# Altium project STM32H747IGT6_IsolatedAudioDSP.PrjPcb
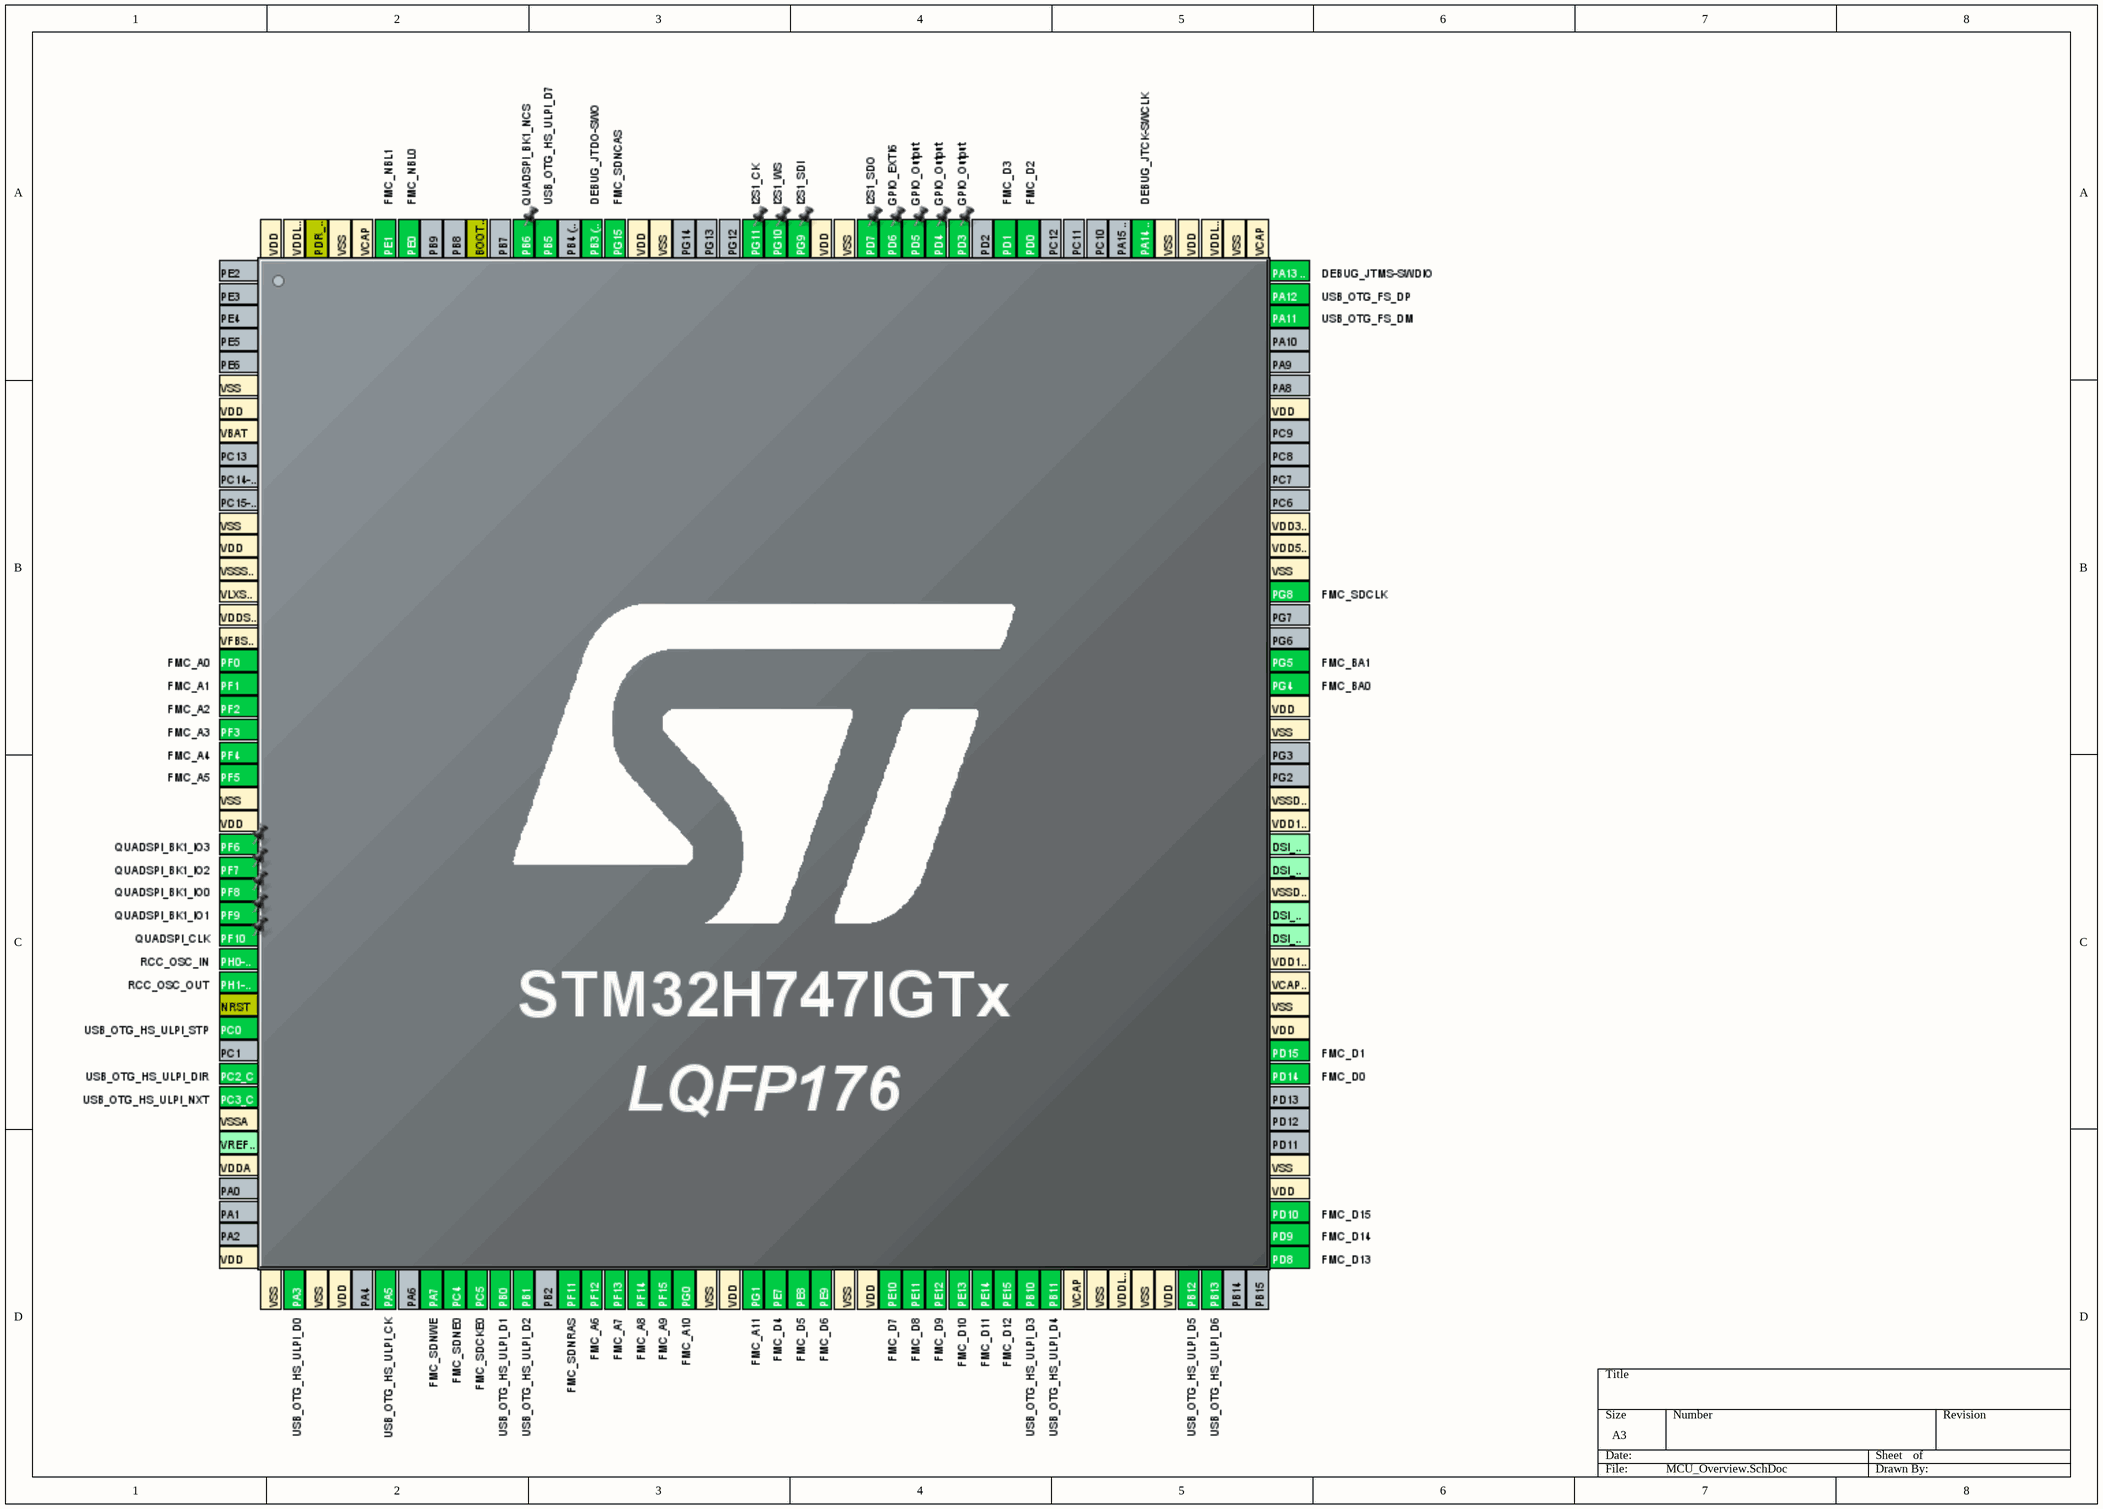
[diagram p0: MCU_Overview.SchDoc]
9 sheets, 181 parts. Net scope: global (net labels, ports and power ports of the same name join across sheets).
Board file: DSPBoardPCBDesign.PcbDoc
Sheets:
  MCU_Overview.SchDoc
  PowerSupply.SchDoc
  Decoupling.SchDoc
  MCUConfig.SchDoc
  SDRAMModule.SchDoc
  GPIOPins.SchDoc
  USBHSULPI.SchDoc
  IsolationBarriers.SchDoc
  AudioCodec.SchDoc

## Sheet MCU_Overview.SchDoc
size A3; SheetNumber: 1; SheetTotal: 7

## Sheet PowerSupply.SchDoc
size A4; SheetNumber: 2; SheetTotal: 8
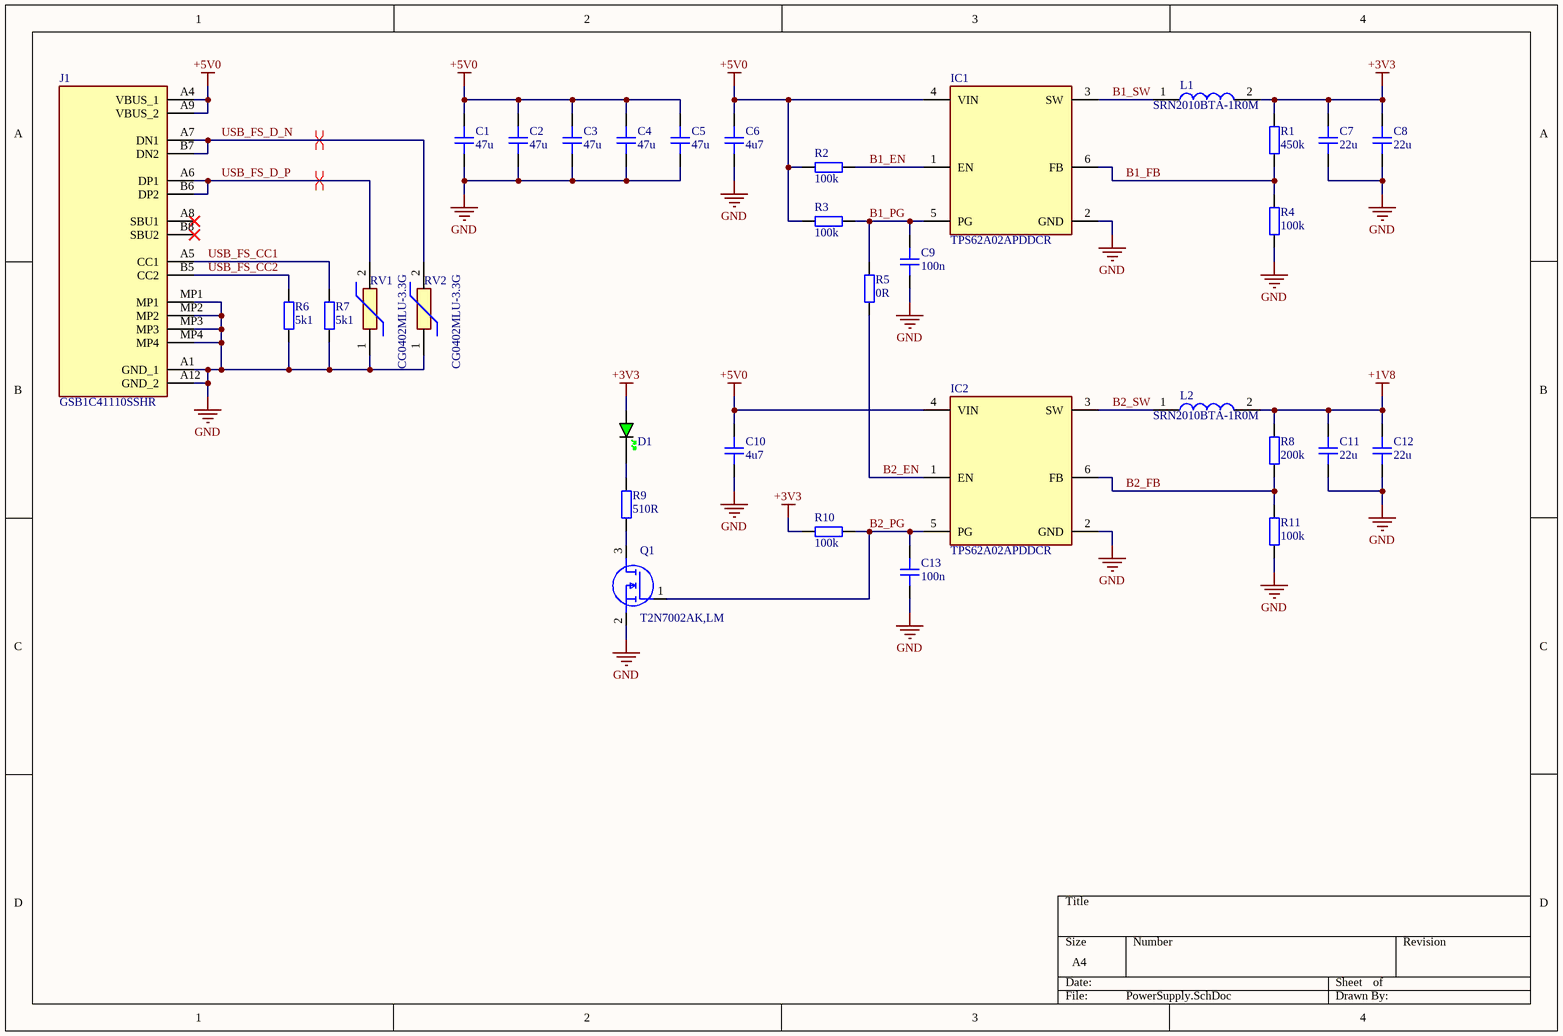
[diagram p1: PowerSupply.SchDoc]

### Parts
C1  47u  [CAP_1210]
C2  47u  [CAP_1210]
C3  47u  [CAP_1210]
C4  47u  [CAP_1210]
C5  47u  [CAP_1210]
C6  4u7  [CAP_0603]
C7  22u  [CAP_0603]
C8  22u  [CAP_0603]
C9  100n  [CAP_0402]
C10  4u7  [CAP_0603]
C11  22u  [CAP_0603]
C12  22u  [CAP_0603]
C13  100n  [CAP_0402]
D1  GREEN  [LED_0603_GREEN]  (value not drawn)
IC1  TPS62A02APDDCR  [SOT95P280X110-6N - duplicate]
IC2  TPS62A02APDDCR  [SOT95P280X110-6N - duplicate]
J1  GSB1C41110SSHR  [GSB1C41110SSHR]
L1  SRN2010BTA-1R0M  [SRN2010BTA1R0M]
L2  SRN2010BTA-1R0M  [SRN2010BTA1R0M]
Q1  T2N7002AK,LM  [TBAT54CLM]
R1  450k  [RES_0402]
R2  100k  [RES_0402]
R3  100k  [RES_0402]
R4  100k  [RES_0402]
R5  0R  [RES_0402]
R6  5k1  [RES_0402]
R7  5k1  [RES_0402]
R8  200k  [RES_0402]
R9  510R  [RES_0603]
R10  100k  [RES_0402]
R11  100k  [RES_0402]
RV1  CG0402MLU-3.3G  [VARC1005X41N]
RV2  CG0402MLU-3.3G  [VARC1005X41N]

### Nets
+1V8: C11.2 C12.2 L2.2 R8.2
+3V3: C7.2 C8.2 D1.A L1.2 R1.2 R10.1
+5V0: C1.2 C2.2 C3.2 C4.2 C5.2 C6.2 C10.2 IC1.4(VIN) IC2.4(VIN) J1.A4(VBUS_1) J1.A9(VBUS_2) R2.1 R3.1
GND: C1.1 C2.1 C3.1 C4.1 C5.1 C6.1 C7.1 C8.1 C9.1 C10.1 C11.1 C12.1 C13.1 IC1.2(GND) IC2.2(GND) J1.A1(GND_1) J1.A12(GND_2) J1.MP1 J1.MP2 J1.MP3 J1.MP4 Q1.2(S) R4.1 R6.2 R7.2 R11.1 RV1.1 RV2.1
B1_EN: IC1.1(EN) R2.2
B1_FB: IC1.6(FB) R1.1 R4.2
B1_PG: C9.2 IC1.5(PG) R3.2 R5.2
B1_SW: IC1.3(SW) L1.1
B2_EN: IC2.1(EN) R5.1
B2_FB: IC2.6(FB) R8.1 R11.2
B2_PG: C13.2 IC2.5(PG) Q1.1(G) R10.2
B2_SW: IC2.3(SW) L2.1
USB_FS_CC1: J1.A5(CC1) R7.1
USB_FS_CC2: J1.B5(CC2) R6.1
USB_FS_D_N: J1.A7(DN1) J1.B7(DN2) RV2.2
USB_FS_D_P: J1.A6(DP1) J1.B6(DP2) RV1.2
NetD1_K: D1.K R9.2
NetQ1_3: Q1.3(D) R9.1

Not connected (* = marked no-connect by the designer): J1 A8(SBU1)* B8(SBU2)*

### Layout directives
differential pair: USB_FS_D_N, USB_FS_D_P

### Library data of the parts
C1-C5 = CAP_1210: Capacitor SMD 1210; Manufacturer: *; Manufacturer Part Number: *; Distributor Link: *; LCSC: *; Rating: *; Dielectric: *
C6-C8 C10-C12 = CAP_0603: Capacitor SMD 0603; Manufacturer: *; Manufacturer Part Number: *; Distributor Link: *; LCSC: *; Rating: *; Dielectric: *
C9 C13 = CAP_0402: Capacitor SMD 0402; Manufacturer: *; Manufacturer Part Number: *; Distributor Link: *; LCSC: *; Rating: *; Dielectric: *
D1 = LED_0603_GREEN: LED 0603 GREEN SMD
IC1 IC2 = TPS62A02APDDCR: Integrated Circuit; Manufacturer_Name: Texas Instruments; Datasheet Link: https://www.ti.com/lit/ds/symlink/tps62a02a.pdf?ts=1731815729746&ref_url=https%253A%252F%252Fwww.ti.com%252Fproduct%252FTPS62A02A%252Fpart-details%252FTPS62A02APDDCR%253Futm_source%253Dgoogle%2526utm_medium%253Dcpc%2526utm_campaign%253Docb-tistore-null-ap; Height: 1.1mm; Manufacturer_Part_Number: TPS62A02APDDCR; Mouser Part Number: 595-TPS62A02APDDCR; Mouser Price/Stock: https://www.mouser.co.uk/ProductDetail/Texas-Instruments/TPS62A02APDDCR?qs=ZcfC38r4PotJY8Nb5BNo3Q%3D%3D; Arrow Part Number: TPS62A02APDDCR; Arrow Price/Stock: https://www.arrow.com/en/products/tps62a02apddcr/texas-instruments?utm_currency=USD&region=nac
J1 = GSB1C41110SSHR: Connector; Manufacturer_Name: Amphenol Communications Solutions; Datasheet Link: https://cdn.amphenol-cs.com/media/wysiwyg/files/drawing/gsb1c41x10sshr-ax1.pdf; Height: 3.41mm; Manufacturer_Part_Number: GSB1C41110SSHR
L1 L2 = SRN2010BTA-1R0M: Inductor; Manufacturer_Name: Bourns; Datasheet Link: https://www.bourns.com/docs/Product-Datasheets/SRN2010BTA.pdf; Height: 1mm; Manufacturer_Part_Number: SRN2010BTA-1R0M
Q1 = T2N7002AK,LM: MOSFET (N-Channel); Manufacturer_Name: Toshiba; Datasheet Link: http://toshiba.semicon-storage.com/info/docget.jsp?did=29712&prodName=T2N7002AK; Height: 1.1mm; Manufacturer_Part_Number: T2N7002AK,LM; Mouser Part Number: 757-T2N7002AKLM; Mouser Price/Stock: https://www.mouser.co.uk/ProductDetail/Toshiba/T2N7002AKLM?qs=pzVvXTvk9PzfX4hYglwZ9Q%3D%3D; Arrow Part Number: T2N7002AK,LM; Arrow Price/Stock: https://www.arrow.com/en/products/t2n7002aklm/toshiba?region=nac
R1-R8 R10 R11 = RES_0402: Resistor SMD 0402; Manufacturer: *; Manufacturer Part Number: *; Distributor Link: *; LCSC: *
R9 = RES_0603: Resistor SMD 0603; Manufacturer: *; Manufacturer Part Number: *; Distributor Link: *; LCSC: *
RV1 RV2 = CG0402MLU-3.3G: ESD Diode; Manufacturer_Name: Bourns; Datasheet Link: https://www.bourns.com/docs/Product-Datasheets/MLU.pdf; Height: 0.41mm; Manufacturer_Part_Number: CG0402MLU-3.3G; Mouser Part Number: 652-CG0402MLU-3.3G; Mouser Price/Stock: https://www.mouser.co.uk/ProductDetail/Bourns/CG0402MLU-3.3G?qs=m8myXnDJXpWVM8EQWErxtQ%3D%3D; Arrow Part Number: CG0402MLU-3.3G; Arrow Price/Stock: https://www.arrow.com/en/products/cg0402mlu-3.3g/bourns?utm_currency=USD&region=nac

## Sheet Decoupling.SchDoc
size A4; SheetNumber: 3; SheetTotal: 8
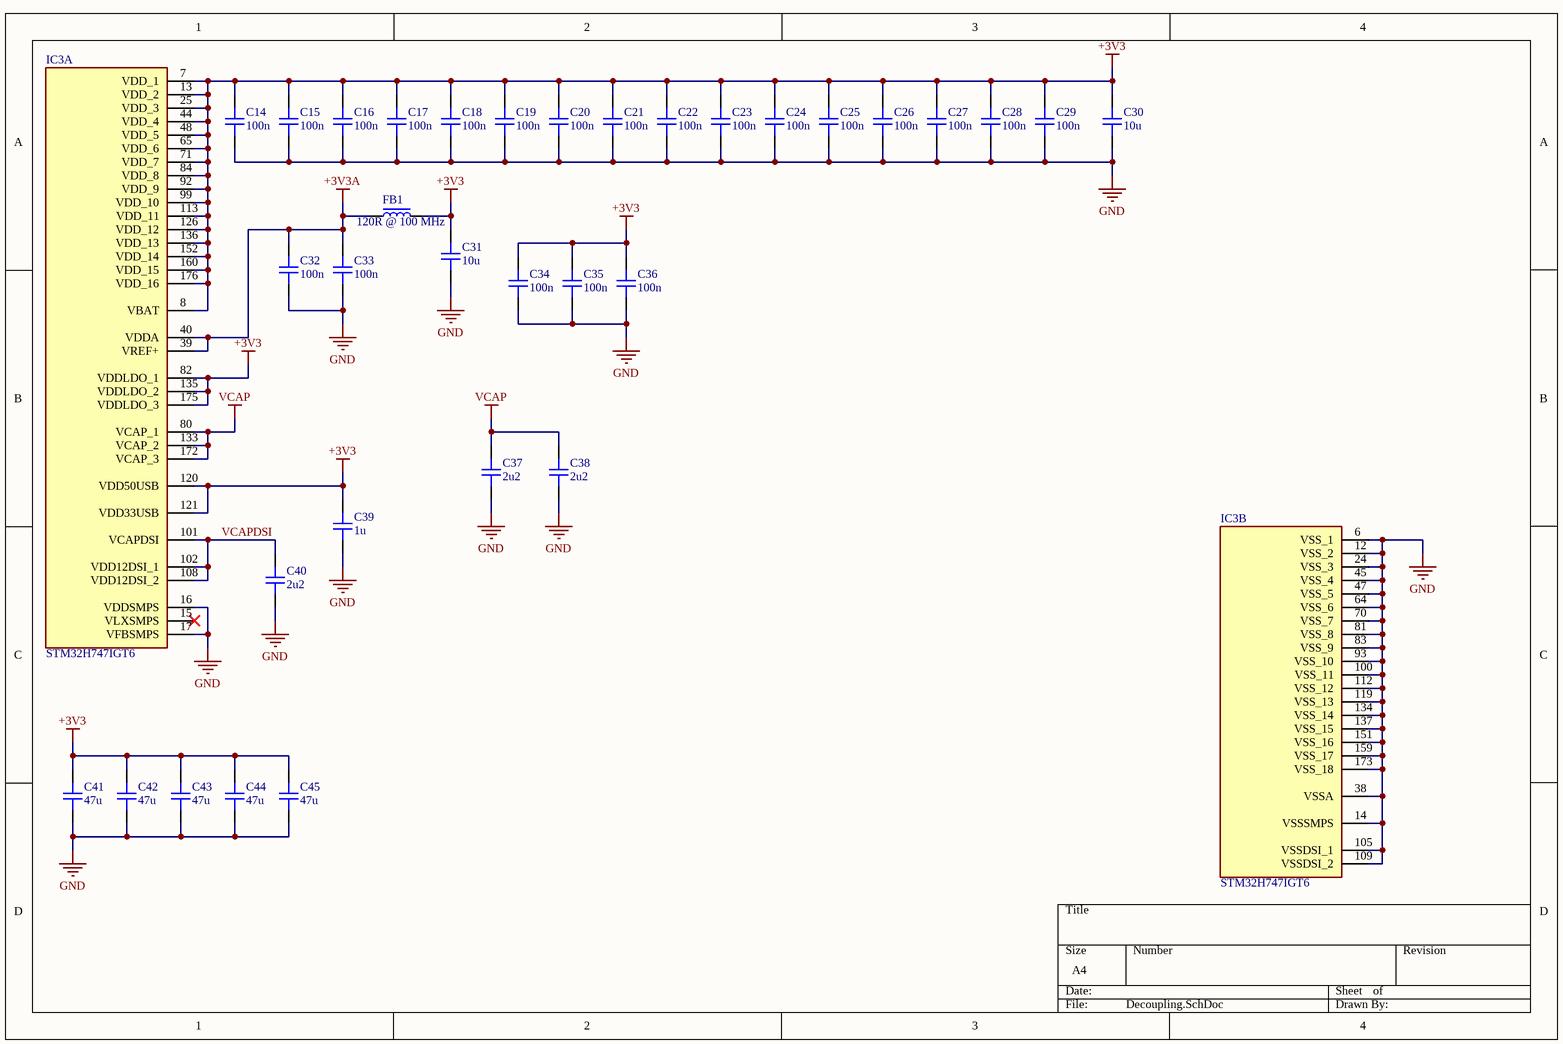
[diagram p2: Decoupling.SchDoc]

### Parts
C14  100n  [CAP_0402]
C15  100n  [CAP_0402]
C16  100n  [CAP_0402]
C17  100n  [CAP_0402]
C18  100n  [CAP_0402]
C19  100n  [CAP_0402]
C20  100n  [CAP_0402]
C21  100n  [CAP_0402]
C22  100n  [CAP_0402]
C23  100n  [CAP_0402]
C24  100n  [CAP_0402]
C25  100n  [CAP_0402]
C26  100n  [CAP_0402]
C27  100n  [CAP_0402]
C28  100n  [CAP_0402]
C29  100n  [CAP_0402]
C30  10u  [CAP_0603]
C31  10u  [CAP_0603]
C32  100n  [CAP_0402]
C33  100n  [CAP_0402]
C34  100n  [CAP_0402]
C35  100n  [CAP_0402]
C36  100n  [CAP_0402]
C37  2u2  [CAP_0402]
C38  2u2  [CAP_0402]
C39  1u  [CAP_0402]
C40  2u2  [CAP_0402]
C41  47u  [CAP_1210]
C42  47u  [CAP_1210]
C43  47u  [CAP_1210]
C44  47u  [CAP_1210]
C45  47u  [CAP_1210]
FB1  120R @ 100 MHz  [FB_0402]
IC3  STM32H747IGT6  [QFP50P2600X2600X160-176N]  (parts A,B of 10)

### Nets
+3V3: C14.2 C15.2 C16.2 C17.2 C18.2 C19.2 C20.2 C21.2 C22.2 C23.2 C24.2 C25.2 C26.2 C27.2 C28.2 C29.2 C30.2 C31.2 C34.2 C35.2 C36.2 C39.2 C41.2 C42.2 C43.2 C44.2 C45.2 FB1.2 IC3.7(VDD_1) IC3.8(VBAT) IC3.13(VDD_2) IC3.25(VDD_3) IC3.44(VDD_4) IC3.48(VDD_5) IC3.65(VDD_6) IC3.71(VDD_7) IC3.82(VDDLDO_1) IC3.84(VDD_8) IC3.92(VDD_9) IC3.99(VDD_10) IC3.113(VDD_11) IC3.120(VDD50USB) IC3.121(VDD33USB) IC3.126(VDD_12) IC3.135(VDDLDO_2) IC3.136(VDD_13) IC3.152(VDD_14) IC3.160(VDD_15) IC3.175(VDDLDO_3) IC3.176(VDD_16)
+3V3A: C32.2 C33.2 FB1.1 IC3.39(VREF+) IC3.40(VDDA)
GND: C14.1 C15.1 C16.1 C17.1 C18.1 C19.1 C20.1 C21.1 C22.1 C23.1 C24.1 C25.1 C26.1 C27.1 C28.1 C29.1 C30.1 C31.1 C32.1 C33.1 C34.1 C35.1 C36.1 C37.1 C38.1 C39.1 C40.1 C41.1 C42.1 C43.1 C44.1 C45.1 IC3.6(VSS_1) IC3.12(VSS_2) IC3.14(VSSSMPS) IC3.16(VDDSMPS) IC3.17(VFBSMPS) IC3.24(VSS_3) IC3.38(VSSA) IC3.45(VSS_4) IC3.47(VSS_5) IC3.64(VSS_6) IC3.70(VSS_7) IC3.81(VSS_8) IC3.83(VSS_9) IC3.93(VSS_10) IC3.100(VSS_11) IC3.105(VSSDSI_1) IC3.109(VSSDSI_2) IC3.112(VSS_12) IC3.119(VSS_13) IC3.134(VSS_14) IC3.137(VSS_15) IC3.151(VSS_16) IC3.159(VSS_17) IC3.173(VSS_18)
VCAP: C37.2 C38.2 IC3.80(VCAP_1) IC3.133(VCAP_2) IC3.172(VCAP_3)
VCAPDSI: C40.2 IC3.101(VCAPDSI) IC3.102(VDD12DSI_1) IC3.108(VDD12DSI_2)

Not connected (* = marked no-connect by the designer): IC3 15(VLXSMPS)*

### Library data of the parts
C14-C29 C32-C40 = CAP_0402: Capacitor SMD 0402; Manufacturer: *; Manufacturer Part Number: *; Distributor Link: *; LCSC: *; Rating: *; Dielectric: *
C30 C31 = CAP_0603: Capacitor SMD 0603; Manufacturer: *; Manufacturer Part Number: *; Distributor Link: *; LCSC: *; Rating: *; Dielectric: *
C41-C45 = CAP_1210: Capacitor SMD 1210; Manufacturer: *; Manufacturer Part Number: *; Distributor Link: *; LCSC: *; Rating: *; Dielectric: *
FB1 = FB_0402: Ferrite Bead SMD 0402; Manufacturer: *; Manufacturer Part Number: *; Distributor Link: *; LCSC: *
IC3 = STM32H747IGT6: Integrated Circuit; Manufacturer_Name: STMicroelectronics; Datasheet Link: https://www.mouser.com/datasheet/2/389/dm00602212-1799407.pdf; Height: 1.6mm; Manufacturer_Part_Number: STM32H747IGT6; Mouser Part Number: 511-STM32H747IGT6; Mouser Price/Stock: https://www.mouser.co.uk/ProductDetail/STMicroelectronics/STM32H747IGT6?qs=%252B6g0mu59x7Kw%252BsPEalqvLg%3D%3D; Arrow Part Number: STM32H747IGT6; Arrow Price/Stock: null?region=nac

## Sheet MCUConfig.SchDoc
size A4; SheetNumber: 4; SheetTotal: 8
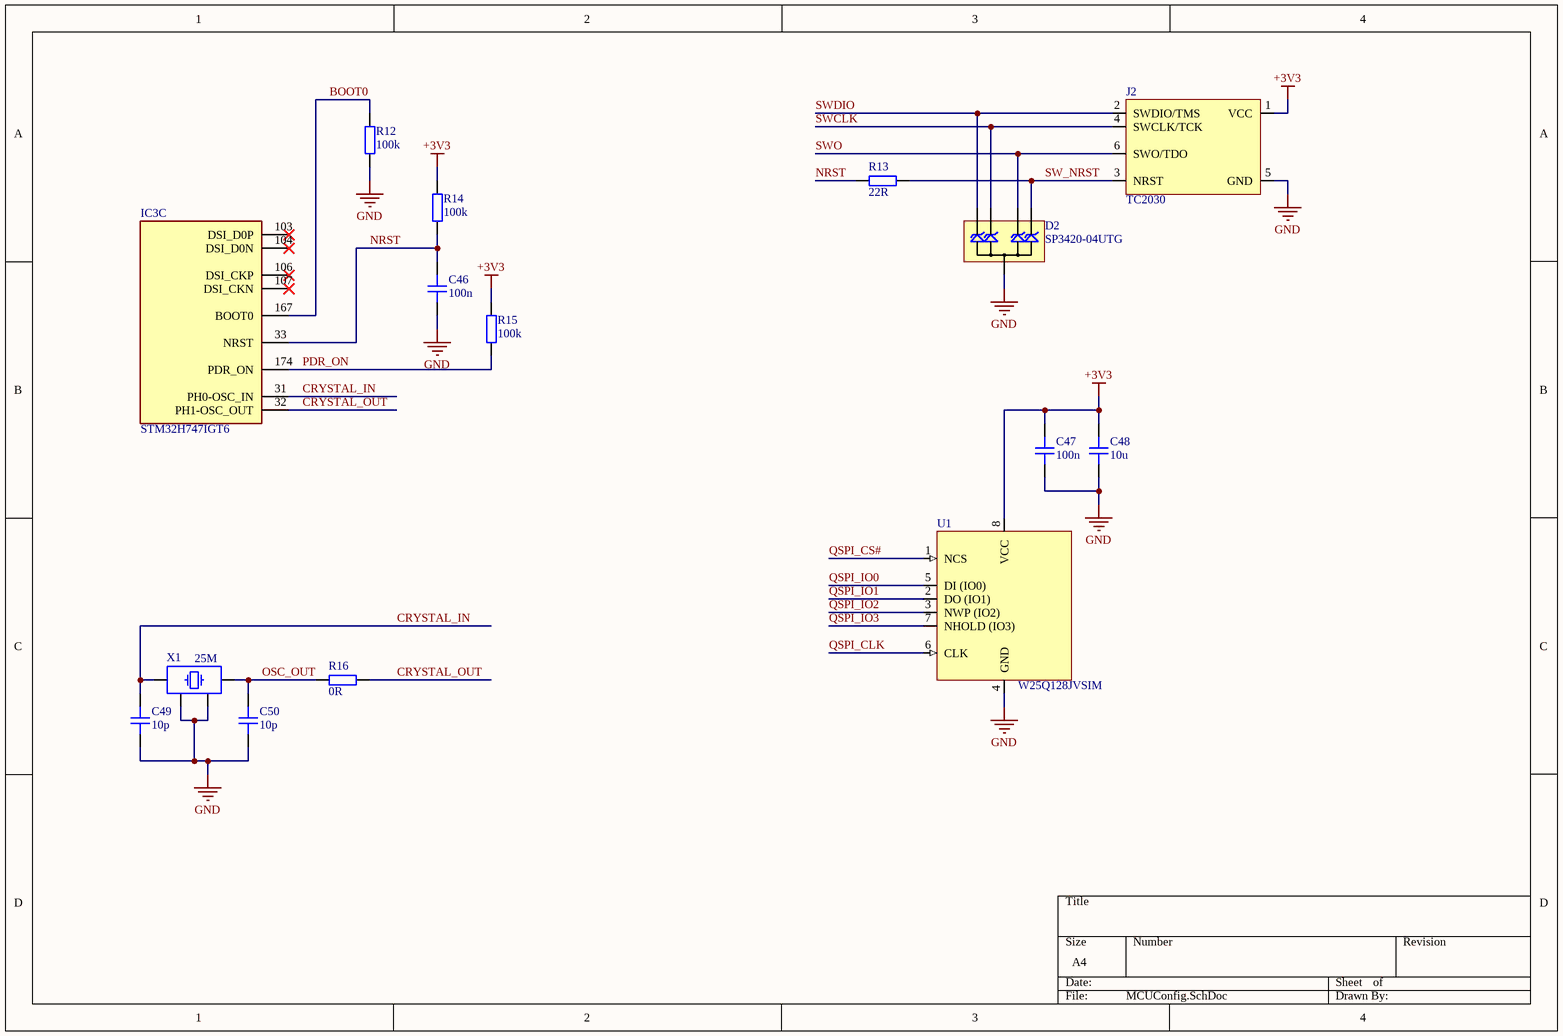
[diagram p3: MCUConfig.SchDoc]

### Parts
C46  100n  [CAP_0402]
C47  100n  [CAP_0402]
C48  10u  [CAP_0603]
C49  10p  [CAP_0402]
C50  10p  [CAP_0402]
D2  SP3420-04UTG  [uDFN-10]
IC3  STM32H747IGT6  [QFP50P2600X2600X160-176N]  (part C of 10)
J2  TC2030  [TC2030-FP]  (no BOM)
R12  100k  [RES_0402]
R13  22R  [RES_0402]
R14  100k  [RES_0402]
R15  100k  [RES_0402]
R16  0R  [RES_0402]
U1  W25Q128JVSIM  [SOIC-8]
X1  25M  [XTAL_3225]

### Nets
+3V3: C47.2 C48.2 J2.1(VCC) R14.2 R15.2 U1.8(VCC)
GND: C46.1 C47.1 C48.1 C49.1 C50.1 D2.38(GND) J2.5(GND) R12.1 U1.4(GND) X1.2 X1.4
BOOT0: IC3.167(BOOT0) R12.2
CRYSTAL_IN: C49.2 IC3.31(PH0-OSC_IN) X1.1
CRYSTAL_OUT: IC3.32(PH1-OSC_OUT) R16.2
NRST: C46.2 IC3.33(NRST) R13.2 R14.1
OSC_OUT: C50.2 R16.1 X1.3
PDR_ON: IC3.174(PDR_ON) R15.1
QSPI_CLK: U1.6(CLK)
QSPI_CS#: U1.1(NCS)
QSPI_IO0: U1.5(DI_(IO0))
QSPI_IO1: U1.2(DO_(IO1))
QSPI_IO2: U1.3(NWP_(IO2))
QSPI_IO3: U1.7(NHOLD_(IO3))
SW_NRST: D2.56 J2.3(NRST) R13.1
SWCLK: D2.29 J2.4(SWCLK/TCK)
SWDIO: D2.110 J2.2(SWDIO/TMS)
SWO: D2.47 J2.6(SWO/TDO)

Not connected (* = marked no-connect by the designer): IC3 103(DSI_D0P)* 104(DSI_D0N)* 106(DSI_CKP)* 107(DSI_CKN)*

### Library data of the parts
C46 C47 C49 C50 = CAP_0402: Capacitor SMD 0402; Manufacturer: *; Manufacturer Part Number: *; Distributor Link: *; LCSC: *; Rating: *; Dielectric: *
C48 = CAP_0603: Capacitor SMD 0603; Manufacturer: *; Manufacturer Part Number: *; Distributor Link: *; LCSC: *; Rating: *; Dielectric: *
D2 = SP3420-04UTG: TVS Diode Array Low Capacitance ESD Protection 4-Channel (Vwork=3V3, Vclamp=6V); Manufacturer: Littelfuse; Manufacturer Part Number: SP3420-04UTG
IC3 = STM32H747IGT6: as IC3 on sheet Decoupling; Datasheet Link: https://www.mouser.com/datasheet/2/389/dm00602212-1799407.pdf; Height: 1.6mm; Manufacturer_Part_Number: STM32H747IGT6; Mouser Part Number: 511-STM32H747IGT6; Mouser Price/Stock: https://www.mouser.co.uk/ProductDetail/STMicroelectronics/STM32H747IGT6?qs=%252B6g0mu59x7Kw%252BsPEalqvLg%3D%3D; Arrow Part Number: STM32H747IGT6; Arrow Price/Stock: null?region=nac
J2 = TC2030: Tag-Connect No-Solder SWD Debug Connector DO NOT PLACE; Manufacturer: Tag-Connect; Manufacturer Part Number: TC2030
R12-R16 = RES_0402: Resistor SMD 0402; Manufacturer: *; Manufacturer Part Number: *; Distributor Link: *; LCSC: *
U1 = W25Q128JVSIM: 128M-BIT / SERIAL FLASH MEMORY WITH / DUAL/QUAD SPI & QPI & DTR SOIC-8; Manufacturer: Winbond; Manufacturer Part Number: W25Q128JVSIM
X1 = XTAL_3225: Crystal SMD 3225; Distributor Link: *

## Sheet SDRAMModule.SchDoc
size A4; SheetNumber: 5; SheetTotal: 8
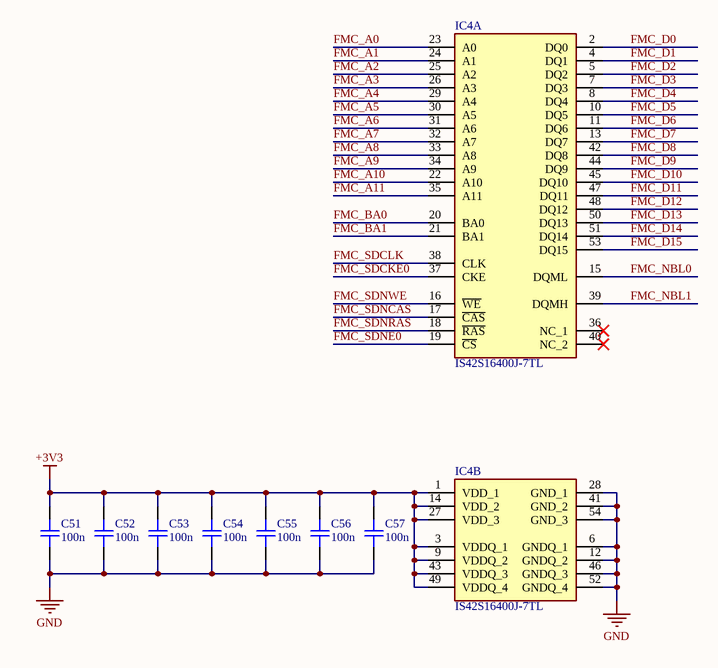
[diagram p4: SDRAMModule.SchDoc]

### Parts
C51  100n  [CAP_0402]
C52  100n  [CAP_0402]
C53  100n  [CAP_0402]
C54  100n  [CAP_0402]
C55  100n  [CAP_0402]
C56  100n  [CAP_0402]
C57  100n  [CAP_0402]
IC4  IS42S16400J-7TL  [SOP80P1176X120-54N]  (parts A,B of 2)

### Nets
+3V3: C51.2 C52.2 C53.2 C54.2 C55.2 C56.2 C57.2 IC4.1(VDD_1) IC4.3(VDDQ_1) IC4.9(VDDQ_2) IC4.14(VDD_2) IC4.27(VDD_3) IC4.43(VDDQ_3) IC4.49(VDDQ_4)
GND: C51.1 C52.1 C53.1 C54.1 C55.1 C56.1 C57.1 IC4.6(GNDQ_1) IC4.12(GNDQ_2) IC4.28(GND_1) IC4.41(GND_2) IC4.46(GNDQ_3) IC4.52(GNDQ_4) IC4.54(GND_3)
FMC_A0: IC4.23(A0)
FMC_A1: IC4.24(A1)
FMC_A2: IC4.25(A2)
FMC_A3: IC4.26(A3)
FMC_A4: IC4.29(A4)
FMC_A5: IC4.30(A5)
FMC_A6: IC4.31(A6)
FMC_A7: IC4.32(A7)
FMC_A8: IC4.33(A8)
FMC_A9: IC4.34(A9)
FMC_A10: IC4.22(A10)
FMC_A11: IC4.35(A11)
FMC_BA0: IC4.20(BA0)
FMC_BA1: IC4.21(BA1)
FMC_D0: IC4.2(DQ0)
FMC_D1: IC4.4(DQ1)
FMC_D2: IC4.5(DQ2)
FMC_D3: IC4.7(DQ3)
FMC_D4: IC4.8(DQ4)
FMC_D5: IC4.10(DQ5)
FMC_D6: IC4.11(DQ6)
FMC_D7: IC4.13(DQ7)
FMC_D8: IC4.42(DQ8)
FMC_D9: IC4.44(DQ9)
FMC_D10: IC4.45(DQ10)
FMC_D11: IC4.47(DQ11)
FMC_D12: IC4.48(DQ12)
FMC_D13: IC4.50(DQ13)
FMC_D14: IC4.51(DQ14)
FMC_D15: IC4.53(DQ15)
FMC_NBL0: IC4.15(DQML)
FMC_NBL1: IC4.39(DQMH)
FMC_SDCKE0: IC4.37(CKE)
FMC_SDCLK: IC4.38(CLK)
FMC_SDNCAS: IC4.17(~{CAS})
FMC_SDNE0: IC4.19(~{CS})
FMC_SDNRAS: IC4.18(~{RAS})
FMC_SDNWE: IC4.16(~{WE})

Not connected (* = marked no-connect by the designer): IC4 36(NC_1)* 40(NC_2)*

### Library data of the parts
C51-C57 = CAP_0402: Capacitor SMD 0402; Manufacturer: *; Manufacturer Part Number: *; Distributor Link: *; LCSC: *; Rating: *; Dielectric: *
IC4 = IS42S16400J-7TL: Integrated Circuit; Manufacturer_Name: Integrated Silicon Solution Inc.; Datasheet Link: http://www.issi.com/WW/pdf/42-45S16400J.pdf; Height: 1.2mm; Manufacturer_Part_Number: IS42S16400J-7TL; Mouser Part Number: 870-IS42S16400J-7TL; Mouser Price/Stock: https://www.mouser.co.uk/ProductDetail/ISSI/IS42S16400J-7TL?qs=eOmjsnl%2FhF6%2FoT1%252B3blFIA%3D%3D; Arrow Part Number: IS42S16400J-7TL; Arrow Price/Stock: https://www.arrow.com/en/products/is42s16400j-7tl/integrated-silicon-solution-inc?region=europe

## Sheet GPIOPins.SchDoc
size A4; SheetNumber: 6; SheetTotal: 8
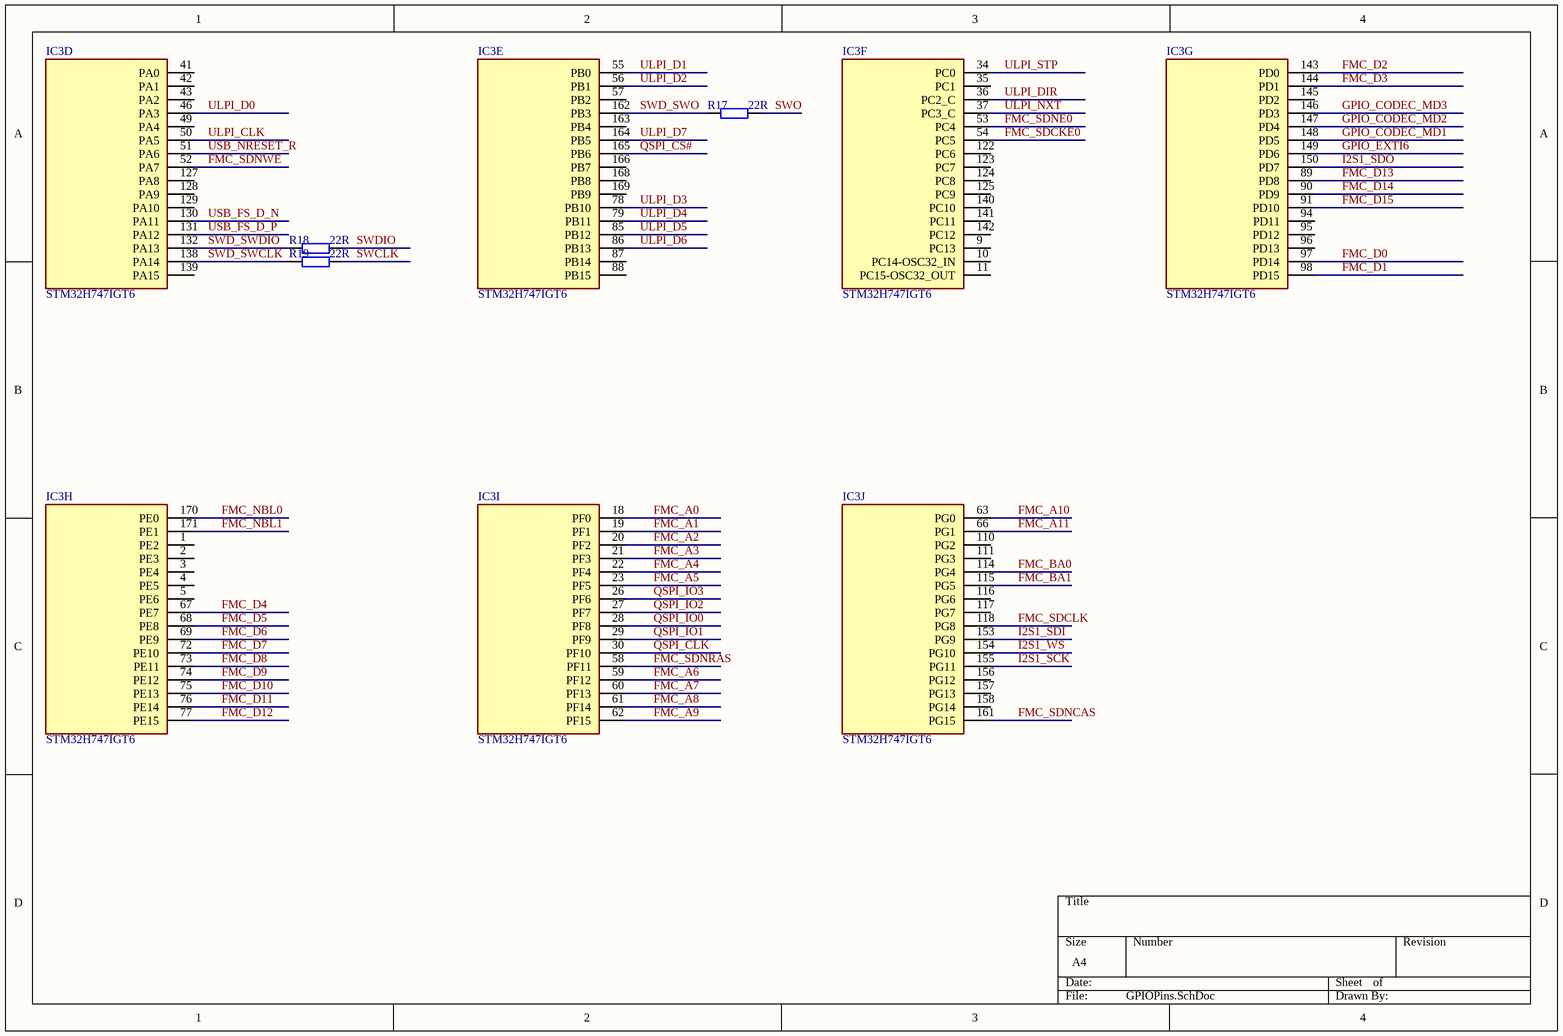
[diagram p5: GPIOPins.SchDoc]

### Parts
IC3  STM32H747IGT6  [QFP50P2600X2600X160-176N]  (parts D,E,F,G,H,I,J of 10)
R17  22R  [RES_0402]
R18  22R  [RES_0402]
R19  22R  [RES_0402]

### Nets
FMC_A0: IC3.18(PF0)
FMC_A1: IC3.19(PF1)
FMC_A2: IC3.20(PF2)
FMC_A3: IC3.21(PF3)
FMC_A4: IC3.22(PF4)
FMC_A5: IC3.23(PF5)
FMC_A6: IC3.59(PF12)
FMC_A7: IC3.60(PF13)
FMC_A8: IC3.61(PF14)
FMC_A9: IC3.62(PF15)
FMC_A10: IC3.63(PG0)
FMC_A11: IC3.66(PG1)
FMC_BA0: IC3.114(PG4)
FMC_BA1: IC3.115(PG5)
FMC_D0: IC3.97(PD14)
FMC_D1: IC3.98(PD15)
FMC_D2: IC3.143(PD0)
FMC_D3: IC3.144(PD1)
FMC_D4: IC3.67(PE7)
FMC_D5: IC3.68(PE8)
FMC_D6: IC3.69(PE9)
FMC_D7: IC3.72(PE10)
FMC_D8: IC3.73(PE11)
FMC_D9: IC3.74(PE12)
FMC_D10: IC3.75(PE13)
FMC_D11: IC3.76(PE14)
FMC_D12: IC3.77(PE15)
FMC_D13: IC3.89(PD8)
FMC_D14: IC3.90(PD9)
FMC_D15: IC3.91(PD10)
FMC_NBL0: IC3.170(PE0)
FMC_NBL1: IC3.171(PE1)
FMC_SDCKE0: IC3.54(PC5)
FMC_SDCLK: IC3.118(PG8)
FMC_SDNCAS: IC3.161(PG15)
FMC_SDNE0: IC3.53(PC4)
FMC_SDNRAS: IC3.58(PF11)
FMC_SDNWE: IC3.52(PA7)
GPIO_CODEC_MD1: IC3.148(PD5)
GPIO_CODEC_MD2: IC3.147(PD4)
GPIO_CODEC_MD3: IC3.146(PD3)
GPIO_EXTI6: IC3.149(PD6)
I2S1_SCK: IC3.155(PG11)
I2S1_SDI: IC3.153(PG9)
I2S1_SDO: IC3.150(PD7)
I2S1_WS: IC3.154(PG10)
QSPI_CLK: IC3.30(PF10)
QSPI_CS#: IC3.165(PB6)
QSPI_IO0: IC3.28(PF8)
QSPI_IO1: IC3.29(PF9)
QSPI_IO2: IC3.27(PF7)
QSPI_IO3: IC3.26(PF6)
SWCLK: R19.1
SWD_SWCLK: IC3.138(PA14) R19.2
SWD_SWDIO: IC3.132(PA13) R18.2
SWD_SWO: IC3.162(PB3) R17.2
SWDIO: R18.1
SWO: R17.1
ULPI_CLK: IC3.50(PA5)
ULPI_D0: IC3.46(PA3)
ULPI_D1: IC3.55(PB0)
ULPI_D2: IC3.56(PB1)
ULPI_D3: IC3.78(PB10)
ULPI_D4: IC3.79(PB11)
ULPI_D5: IC3.85(PB12)
ULPI_D6: IC3.86(PB13)
ULPI_D7: IC3.164(PB5)
ULPI_DIR: IC3.36(PC2_C)
ULPI_NXT: IC3.37(PC3_C)
ULPI_STP: IC3.34(PC0)
USB_FS_D_N: IC3.130(PA11)
USB_FS_D_P: IC3.131(PA12)
USB_NRESET_R: IC3.51(PA6)

Not connected (* = marked no-connect by the designer): IC3 1(PE2) 2(PE3) 3(PE4) 4(PE5) 5(PE6) 9(PC13) 10(PC14-OSC32_IN) 11(PC15-OSC32_OUT) 35(PC1) 41(PA0) 42(PA1) 43(PA2) 49(PA4) 57(PB2) 87(PB14) 88(PB15) 94(PD11) 95(PD12) 96(PD13) 110(PG2) 111(PG3) 116(PG6) 117(PG7) 122(PC6) 123(PC7) 124(PC8) 125(PC9) 127(PA8) 128(PA9) 129(PA10) 139(PA15) 140(PC10) 141(PC11) 142(PC12) 145(PD2) 156(PG12) 157(PG13) 158(PG14) 163(PB4) 166(PB7) 168(PB8) 169(PB9)

### Library data of the parts
IC3 = STM32H747IGT6: as IC3 on sheet Decoupling; Datasheet Link: https://www.mouser.com/datasheet/2/389/dm00602212-1799407.pdf; Height: 1.6mm; Manufacturer_Part_Number: STM32H747IGT6; Mouser Part Number: 511-STM32H747IGT6; Mouser Price/Stock: https://www.mouser.co.uk/ProductDetail/STMicroelectronics/STM32H747IGT6?qs=%252B6g0mu59x7Kw%252BsPEalqvLg%3D%3D; Arrow Part Number: STM32H747IGT6; Arrow Price/Stock: null?region=nac
R17-R19 = RES_0402: Resistor SMD 0402; Manufacturer: *; Manufacturer Part Number: *; Distributor Link: *; LCSC: *

## Sheet USBHSULPI.SchDoc
size A4; SheetNumber: 7; SheetTotal: 8
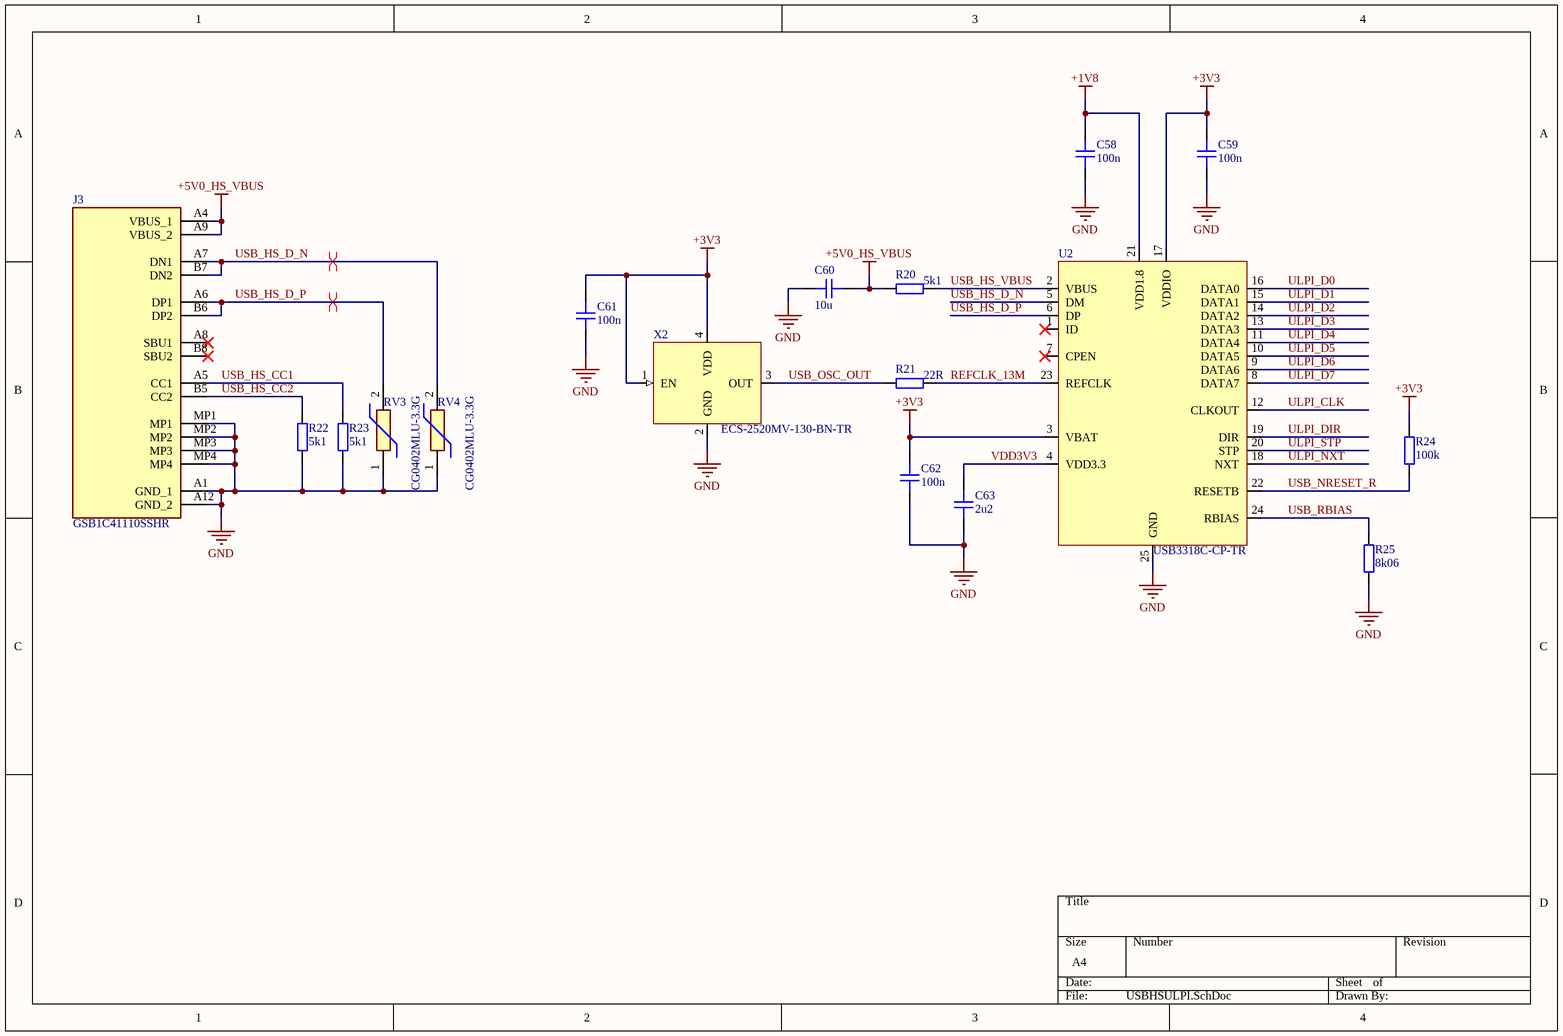
[diagram p6: USBHSULPI.SchDoc]

### Parts
C58  100n  [CAP_0402]
C59  100n  [CAP_0402]
C60  10u  [CAP_0603]
C61  100n  [CAP_0402]
C62  100n  [CAP_0402]
C63  2u2  [CAP_0402]
J3  GSB1C41110SSHR  [GSB1C41110SSHR]
R20  5k1  [RES_0402]
R21  22R  [RES_0402]
R22  5k1  [RES_0402]
R23  5k1  [RES_0402]
R24  100k  [RES_0402]
R25  8k06  [RES_0402]
RV3  CG0402MLU-3.3G  [VARC1005X41N]
RV4  CG0402MLU-3.3G  [VARC1005X41N]
U2  USB3318C-CP-TR  [QFN50P400X400X100-25N-D]
X2  ECS-2520MV-130-BN-TR  [XTAL_2520]

### Nets
+1V8: C58.2 U2.21(VDD1.8)
+3V3: C59.2 C61.2 C62.2 R24.1 U2.3(VBAT) U2.17(VDDIO) X2.1(EN) X2.4(VDD)
+5V0_HS_VBUS: C60.1 J3.A4(VBUS_1) J3.A9(VBUS_2) R20.2
GND: C58.1 C59.1 C60.2 C61.1 C62.1 C63.1 J3.A1(GND_1) J3.A12(GND_2) J3.MP1 J3.MP2 J3.MP3 J3.MP4 R22.2 R23.2 R25.1 RV3.1 RV4.1 U2.25(GND) X2.2(GND)
REFCLK_13M: R21.1 U2.23(REFCLK)
ULPI_CLK: U2.12(CLKOUT)
ULPI_D0: U2.16(DATA0)
ULPI_D1: U2.15(DATA1)
ULPI_D2: U2.14(DATA2)
ULPI_D3: U2.13(DATA3)
ULPI_D4: U2.11(DATA4)
ULPI_D5: U2.10(DATA5)
ULPI_D6: U2.9(DATA6)
ULPI_D7: U2.8(DATA7)
ULPI_DIR: U2.19(DIR)
ULPI_NXT: U2.18(NXT)
ULPI_STP: U2.20(STP)
USB_HS_CC1: J3.A5(CC1) R23.1
USB_HS_CC2: J3.B5(CC2) R22.1
USB_HS_D_N: J3.A7(DN1) J3.B7(DN2) RV4.2 U2.5(DM)
USB_HS_D_P: J3.A6(DP1) J3.B6(DP2) RV3.2 U2.6(DP)
USB_HS_VBUS: R20.1 U2.2(VBUS)
USB_NRESET_R: R24.2 U2.22(RESETB)
USB_OSC_OUT: R21.2 X2.3(OUT)
USB_RBIAS: R25.2 U2.24(RBIAS)
VDD3V3: C63.2 U2.4(VDD3.3)

Not connected (* = marked no-connect by the designer): J3 A8(SBU1)* B8(SBU2)*; U2 1(ID)* 7(CPEN)*

### Layout directives
differential pair: USB_HS_D_N, USB_HS_D_P

### Library data of the parts
C58 C59 C61-C63 = CAP_0402: Capacitor SMD 0402; Manufacturer: *; Manufacturer Part Number: *; Distributor Link: *; LCSC: *; Rating: *; Dielectric: *
C60 = CAP_0603: Capacitor SMD 0603; Manufacturer: *; Manufacturer Part Number: *; Distributor Link: *; LCSC: *; Rating: *; Dielectric: *
J3 = GSB1C41110SSHR: as J1 on sheet PowerSupply; Datasheet Link: https://cdn.amphenol-cs.com/media/wysiwyg/files/drawing/gsb1c41x10sshr-ax1.pdf; Height: 3.41mm; Manufacturer_Part_Number: GSB1C41110SSHR
R20-R25 = RES_0402: Resistor SMD 0402; Manufacturer: *; Manufacturer Part Number: *; Distributor Link: *; LCSC: *
RV3 RV4 = CG0402MLU-3.3G: ESD Diode; Manufacturer_Name: Bourns; Datasheet Link: https://www.bourns.com/docs/Product-Datasheets/MLU.pdf; Height: 0.41mm; Manufacturer_Part_Number: CG0402MLU-3.3G; Mouser Part Number: 652-CG0402MLU-3.3G; Mouser Price/Stock: https://www.mouser.co.uk/ProductDetail/Bourns/CG0402MLU-3.3G?qs=m8myXnDJXpWVM8EQWErxtQ%3D%3D; Arrow Part Number: CG0402MLU-3.3G; Arrow Price/Stock: https://www.arrow.com/en/products/cg0402mlu-3.3g/bourns?utm_currency=USD&region=nac
U2 = USB3318C-CP-TR: USB Interface IC High Speed USB 1.8V ULPI; Manufacturer: Microchip; Manufacturer Part Number: USB3318C-CP-TR
X2 = ECS-2520MV-130-BN-TR: Standard Clock Oscillators XO (Standard),13MHz,Standby (Power Down),CMOS, Multi-Volt,1.6 V 3.6 V,+/-50ppm,-40 C 85 C,6mA,Surface Mount,4-SMD, No Lead,(2.50mm x 2.00mm),(0.80mm); Manufacturer: ECS; Manufacturer Part Number: ECS-2520MV-130-BN-TR

## Sheet IsolationBarriers.SchDoc
size A4; SheetNumber: 8; SheetTotal: 9
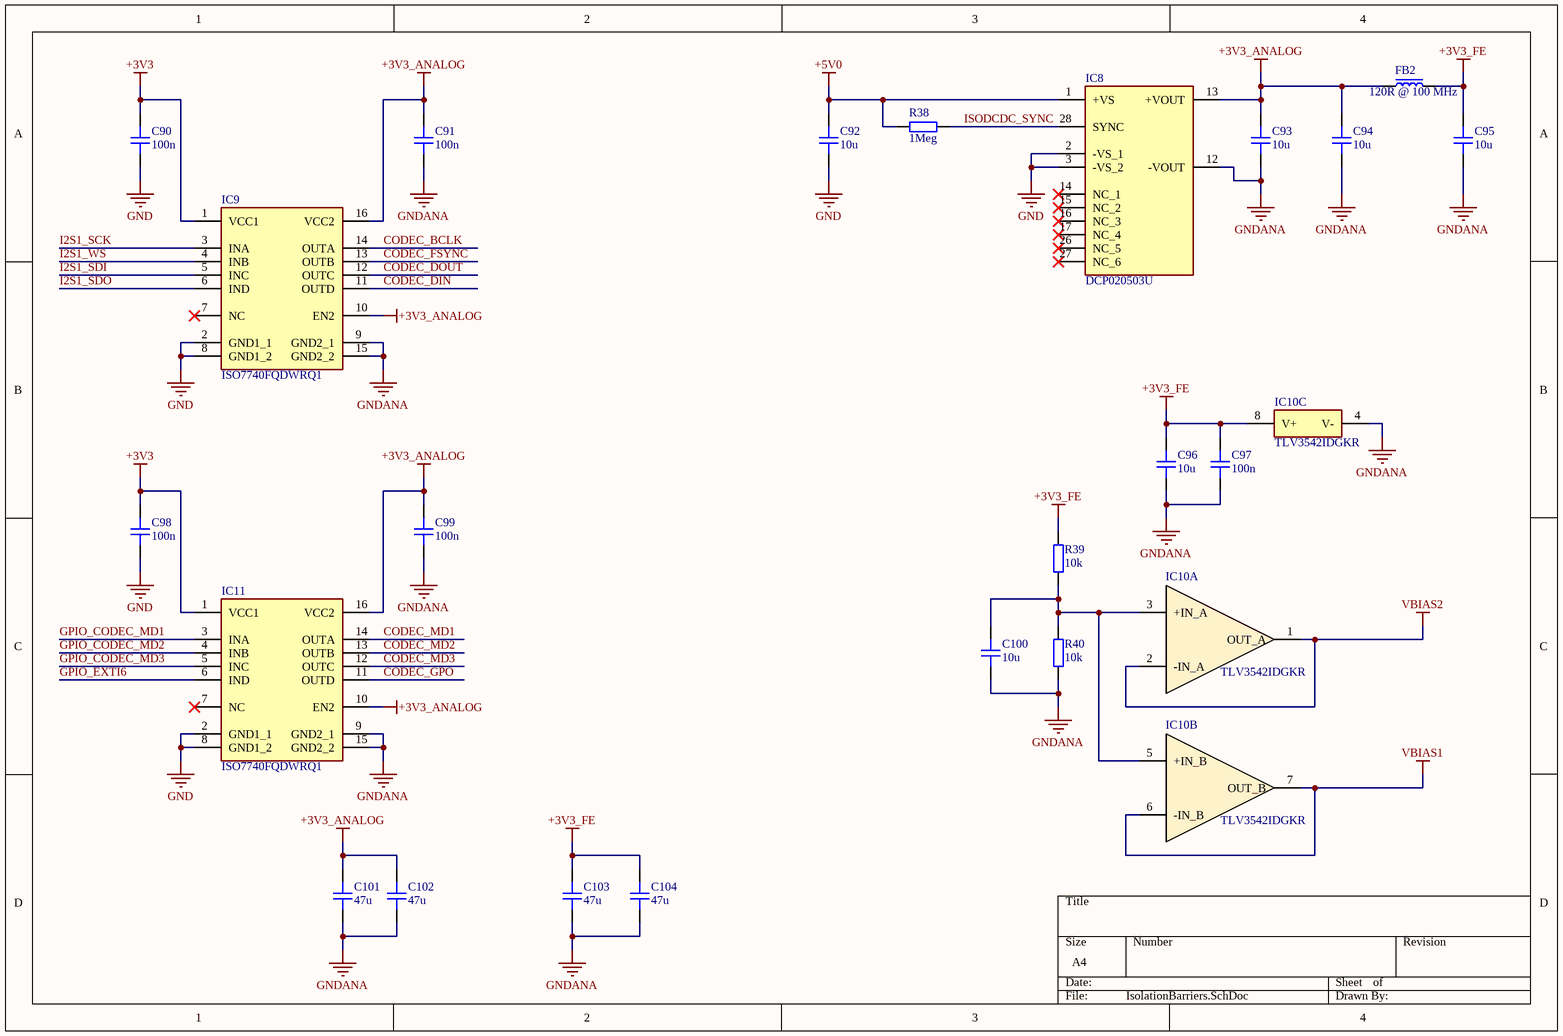
[diagram p7: IsolationBarriers.SchDoc]

### Parts
C90  100n  [CAP_0402]
C91  100n  [CAP_0402]
C92  10u  [CAP_0603]
C93  10u  [CAP_0603]
C94  10u  [CAP_0603]
C95  10u  [CAP_0603]
C96  10u  [CAP_0603]
C97  100n  [CAP_0402]
C98  100n  [CAP_0402]
C99  100n  [CAP_0402]
C100  10u  [CAP_0603]
C101  47u  [CAP_1210]
C102  47u  [CAP_1210]
C103  47u  [CAP_1210]
C104  47u  [CAP_1210]
FB2  120R @ 100 MHz  [FB_0603]
IC8  DCP020503U  [DVB0012A]
IC9  ISO7740FQDWRQ1  [SOIC127P1030X265-16N]
IC10  TLV3542IDGKR  [SOP65P490X110-8N]  (parts A,B,C of 3)
IC11  ISO7740FQDWRQ1  [SOIC127P1030X265-16N]
R38  1Meg  [RES_0402]
R39  10k  [RES_0603]
R40  10k  [RES_0603]

### Nets
+3V3: C90.2 C98.2 IC9.1(VCC1) IC11.1(VCC1)
+3V3_ANALOG: C91.2 C93.2 C94.2 C99.2 C101.2 C102.2 FB2.1 IC8.13(+VOUT) IC9.10(EN2) IC9.16(VCC2) IC11.10(EN2) IC11.16(VCC2)
+3V3_FE: C95.2 C96.2 C97.2 C103.2 C104.2 FB2.2 IC10.8(V+) R39.2
+5V0: C92.2 IC8.1(+VS) R38.1
GND: C90.1 C92.1 C98.1 IC8.2(-VS_1) IC8.3(-VS_2) IC9.2(GND1_1) IC9.8(GND1_2) IC11.2(GND1_1) IC11.8(GND1_2)
GNDANA: C91.1 C93.1 C94.1 C95.1 C96.1 C97.1 C99.1 C100.1 C101.1 C102.1 C103.1 C104.1 IC8.12(-VOUT) IC9.9(GND2_1) IC9.15(GND2_2) IC10.4(V-) IC11.9(GND2_1) IC11.15(GND2_2) R40.1
VBIAS1: IC10.6(-IN_B) IC10.7(OUT_B)
VBIAS2: IC10.1(OUT_A) IC10.2(-IN_A)
CODEC_BCLK: IC9.14(OUTA)
CODEC_DIN: IC9.11(OUTD)
CODEC_DOUT: IC9.12(OUTC)
CODEC_FSYNC: IC9.13(OUTB)
CODEC_GPO: IC11.11(OUTD)
CODEC_MD1: IC11.14(OUTA)
CODEC_MD2: IC11.13(OUTB)
CODEC_MD3: IC11.12(OUTC)
GPIO_CODEC_MD1: IC11.3(INA)
GPIO_CODEC_MD2: IC11.4(INB)
GPIO_CODEC_MD3: IC11.5(INC)
GPIO_EXTI6: IC11.6(IND)
I2S1_SCK: IC9.3(INA)
I2S1_SDI: IC9.5(INC)
I2S1_SDO: IC9.6(IND)
I2S1_WS: IC9.4(INB)
ISODCDC_SYNC: IC8.28(SYNC) R38.2
NetC100_2: C100.2 IC10.3(+IN_A) IC10.5(+IN_B) R39.1 R40.2

Not connected (* = marked no-connect by the designer): IC8 14(NC_1)* 15(NC_2)* 16(NC_3)* 17(NC_4)* 26(NC_5)* 27(NC_6)*; IC9 7(NC)*; IC11 7(NC)*

### Library data of the parts
C90 C91 C97-C99 = CAP_0402: Capacitor SMD 0402; Manufacturer: *; Manufacturer Part Number: *; Distributor Link: *; LCSC: *; Rating: *; Dielectric: *
C92-C96 C100 = CAP_0603: Capacitor SMD 0603; Manufacturer: *; Manufacturer Part Number: *; Distributor Link: *; LCSC: *; Rating: *; Dielectric: *
C101-C104 = CAP_1210: Capacitor SMD 1210; Manufacturer: *; Manufacturer Part Number: *; Distributor Link: *; LCSC: *; Rating: *; Dielectric: *
FB2 = FB_0603: Ferrite Bead SMD 0603; Manufacturer: *; Manufacturer Part Number: *; Distributor Link: *; LCSC: *
IC8 = DCP020503U: TI Isolated DC DC Converter; Manufacturer_Name: Texas Instruments; Datasheet Link: http://www.ti.com/lit/gpn/dcp020503; Manufacturer_Part_Number: DCP020503U; Mouser Part Number: 595-DCP020503U; Mouser Price/Stock: https://www.mouser.com/Search/Refine.aspx?Keyword=595-DCP020503U; Arrow Part Number: DCP020503U; Arrow Price/Stock: https://www.arrow.com/en/products/dcp020503u/texas-instruments
IC9 IC11 = ISO7740FQDWRQ1: Integrated Circuit; Manufacturer_Name: Texas Instruments; Datasheet Link: https://www.ti.com/lit/gpn/iso7740-q1; Height: 2.65mm; Manufacturer_Part_Number: ISO7740FQDWRQ1; Mouser Part Number: 595-ISO7740FQDWRQ1; Mouser Price/Stock: https://www.mouser.co.uk/ProductDetail/Texas-Instruments/ISO7740FQDWRQ1?qs=34RfhUjJmKfM2MieHZI64w%3D%3D; Arrow Part Number: ISO7740FQDWRQ1; Arrow Price/Stock: https://www.arrow.com/en/products/iso7740fqdwrq1/texas-instruments?utm_currency=USD&region=nac
IC10 = TLV3542IDGKR: Integrated Circuit; Manufacturer_Name: Texas Instruments; Datasheet Link: http://www.ti.com/lit/gpn/tlv3542; Height: 1.1mm; Manufacturer_Part_Number: TLV3542IDGKR; Mouser Part Number: 595-TLV3542IDGKR; Mouser Price/Stock: https://www.mouser.co.uk/ProductDetail/Texas-Instruments/TLV3542IDGKR?qs=9lcNTSmDlCr5gl2sVJgJdw%3D%3D; Arrow Part Number: TLV3542IDGKR; Arrow Price/Stock: https://www.arrow.com/en/products/tlv3542idgkr/texas-instruments
R38 = RES_0402: Resistor SMD 0402; Manufacturer: *; Manufacturer Part Number: *; Distributor Link: *; LCSC: *
R39 R40 = RES_0603: Resistor SMD 0603; Manufacturer: *; Manufacturer Part Number: *; Distributor Link: *; LCSC: *

## Sheet AudioCodec.SchDoc
size A3; SheetNumber: 9; SheetTotal: 8
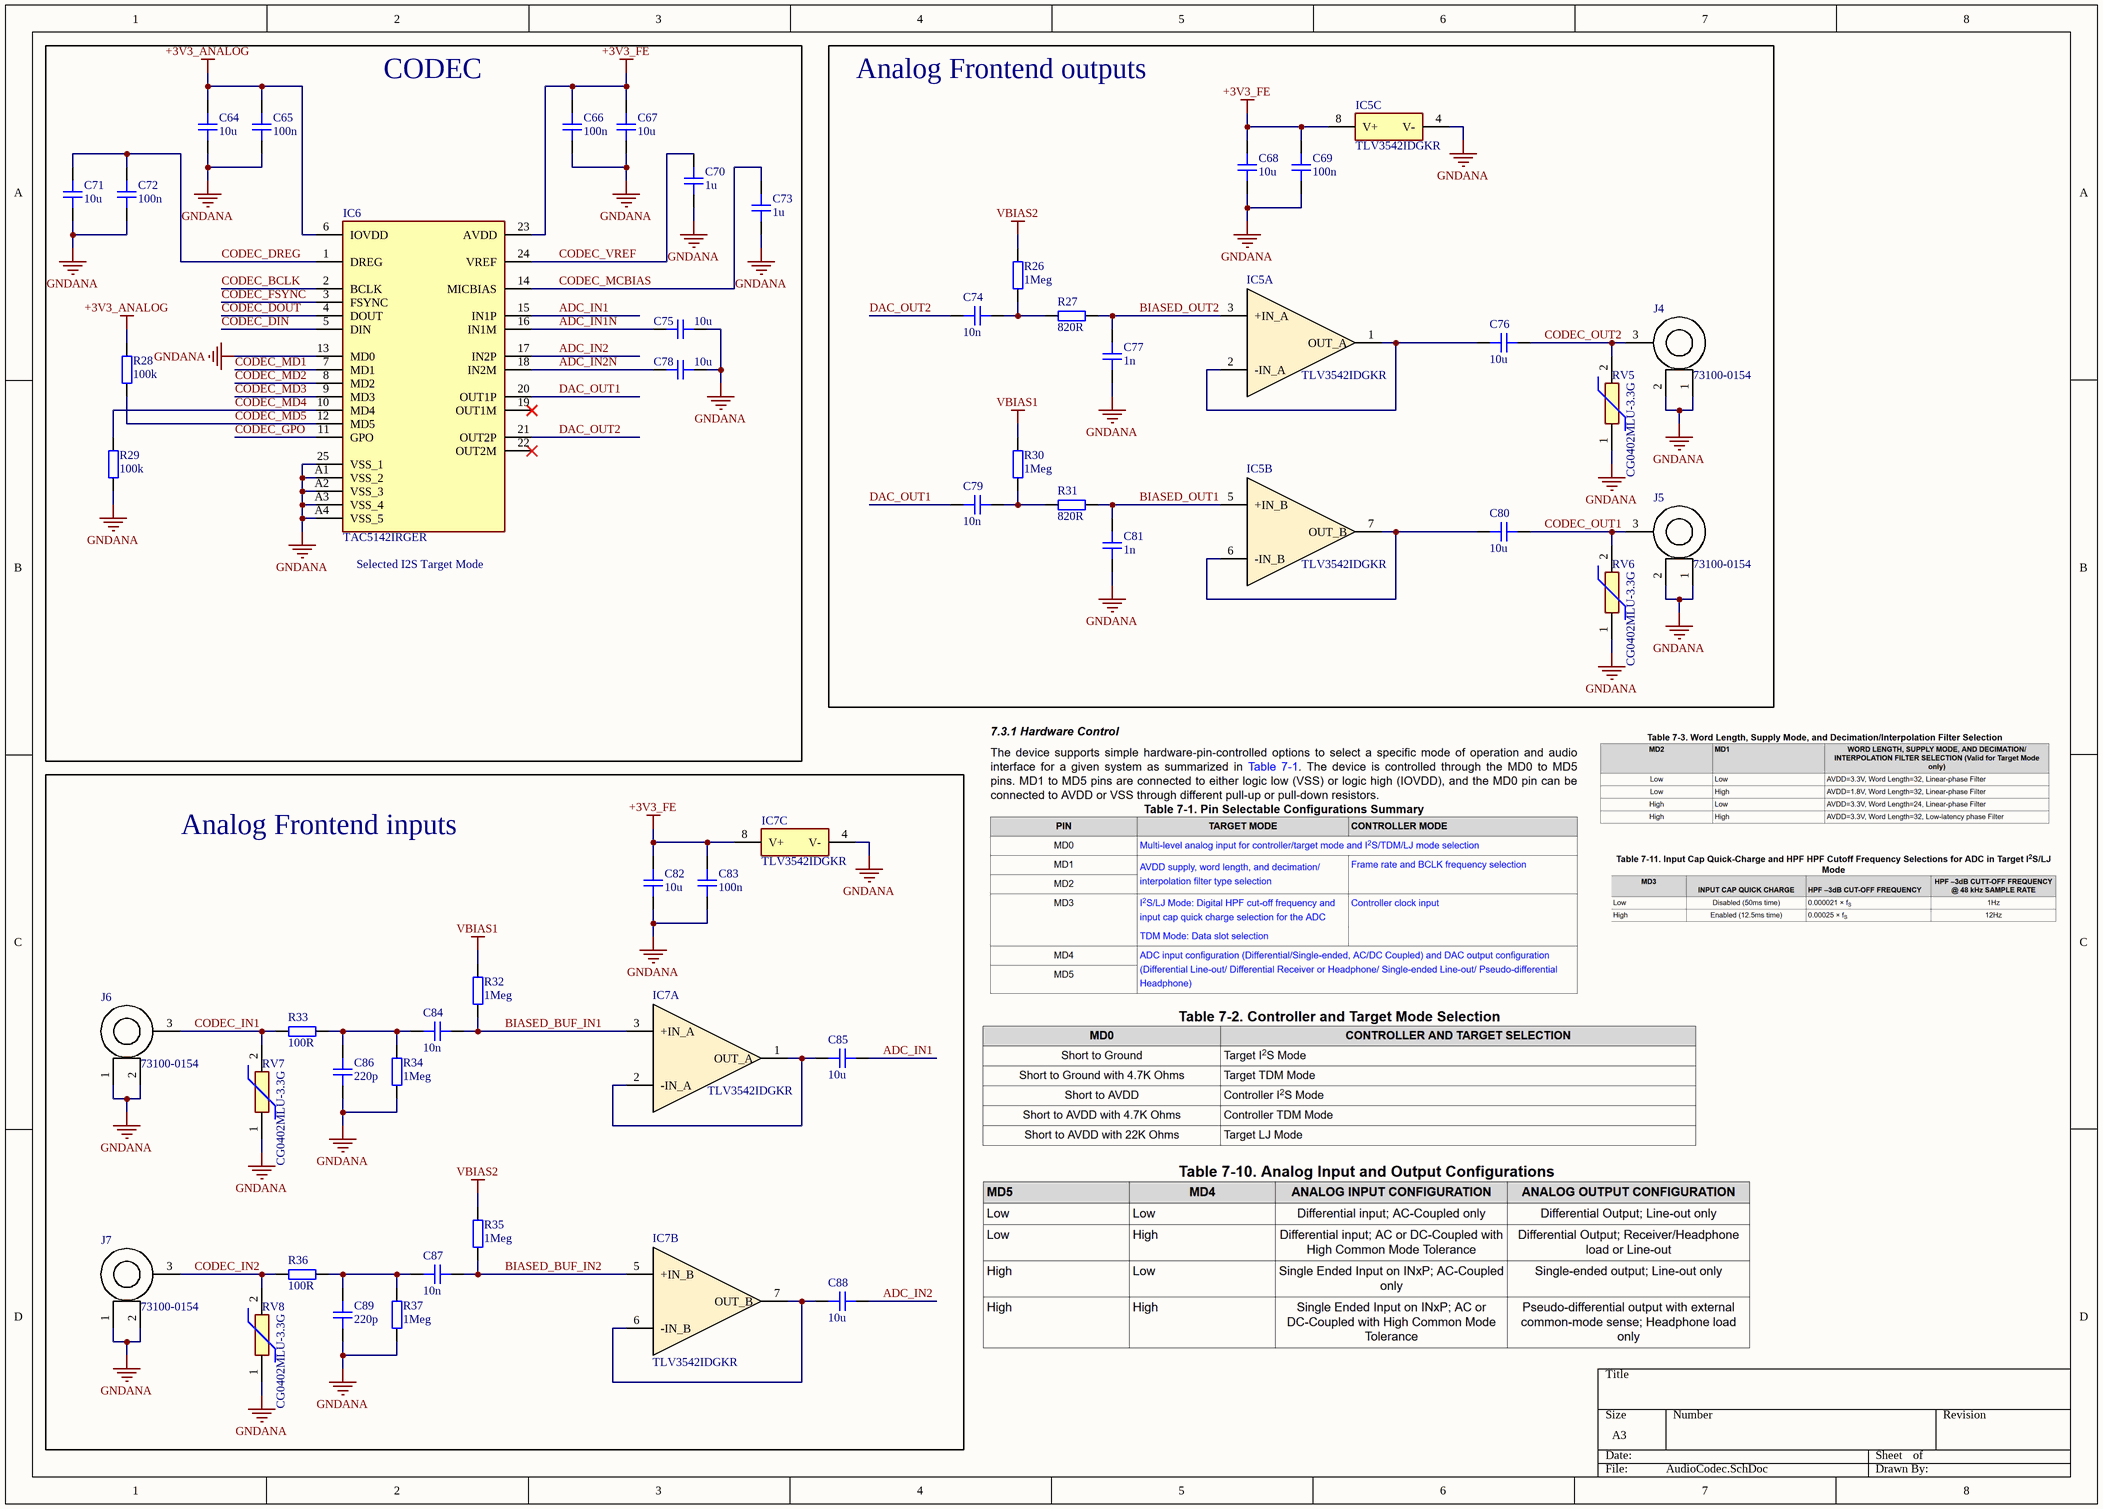
[diagram p8: AudioCodec.SchDoc]

### Parts
C64  10u  [CAP_0603]
C65  100n  [CAP_0402]
C66  100n  [CAP_0402]
C67  10u  [CAP_0603]
C68  10u  [CAP_0603]
C69  100n  [CAP_0402]
C70  1u  [CAP_0402]
C71  10u  [CAP_0603]
C72  100n  [CAP_0402]
C73  1u  [CAP_0402]
C74  10n  [CAP_0402]
C75  10u  [CAP_0603]
C76  10u  [CAP_0603]
C77  1n  [CAP_0402]
C78  10u  [CAP_0603]
C79  10n  [CAP_0402]
C80  10u  [CAP_0603]
C81  1n  [CAP_0402]
C82  10u  [CAP_0603]
C83  100n  [CAP_0402]
C84  10n  [CAP_0402]
C85  10u  [CAP_0603]
C86  220p  [CAP_0402]
C87  10n  [CAP_0402]
C88  10u  [CAP_0603]
C89  220p  [CAP_0402]
IC5  TLV3542IDGKR  [SOP65P490X110-8N]  (parts A,B,C of 3)
IC6  TAC5142IRGER  [TAC5142IRGER]
IC7  TLV3542IDGKR  [SOP65P490X110-8N]  (parts A,B,C of 3)
J4  73100-0154  [73100-0105]
J5  73100-0154  [73100-0105]
J6  73100-0154  [73100-0105]
J7  73100-0154  [73100-0105]
R26  1Meg  [RES_0402]
R27  820R  [RES_0402]
R28  100k  [RES_0402]
R29  100k  [RES_0402]
R30  1Meg  [RES_0402]
R31  820R  [RES_0402]
R32  1Meg  [RES_0402]
R33  100R  [RES_0402]
R34  1Meg  [RES_0402]
R35  1Meg  [RES_0402]
R36  100R  [RES_0402]
R37  1Meg  [RES_0402]
RV5  CG0402MLU-3.3G  [VARC1005X41N]
RV6  CG0402MLU-3.3G  [VARC1005X41N]
RV7  CG0402MLU-3.3G  [VARC1005X41N]
RV8  CG0402MLU-3.3G  [VARC1005X41N]

### Blocks framed on the sheet
CODEC: C64-C67 C70-C73 C75 C78 IC6 R28 R29
Analog Frontend outputs: C68 C69 C74 C76 C77 C79-C81 IC5 J4 J5 R26 R27 R30 R31 RV5 RV6
Analog Frontend inputs: C82-C89 IC7 J6 J7 R32-R37 RV7 RV8

### Nets
+3V3_ANALOG: C64.2 C65.2 IC6.6(IOVDD) R28.2
+3V3_FE: C66.2 C67.2 C68.2 C69.2 C82.2 C83.2 IC5.8(V+) IC6.23(AVDD) IC7.8(V+)
GNDANA: C64.1 C65.1 C66.1 C67.1 C68.1 C69.1 C70.1 C71.1 C72.1 C73.1 C75.1 C77.2 C78.1 C81.2 C82.1 C83.1 C86.1 C89.1 IC5.4(V-) IC6.13(MD0) IC6.25(VSS_1) IC6.A1(VSS_2) IC6.A2(VSS_3) IC6.A3(VSS_4) IC6.A4(VSS_5) IC7.4(V-) J4.1 J4.2 J5.1 J5.2 J6.1 J6.2 J7.1 J7.2 R29.1 R34.1 R37.1 RV5.1 RV6.1 RV7.1 RV8.1
VBIAS1: R30.2 R32.2
VBIAS2: R26.2 R35.2
ADC_IN1: C85.1 IC6.15(IN1P)
ADC_IN1N: C75.2 IC6.16(IN1M)
ADC_IN2: C88.1 IC6.17(IN2P)
ADC_IN2N: C78.2 IC6.18(IN2M)
BIASED_BUF_IN1: C84.1 IC7.3(+IN_A) R32.1
BIASED_BUF_IN2: C87.1 IC7.5(+IN_B) R35.1
BIASED_OUT1: C81.1 IC5.5(+IN_B) R31.1
BIASED_OUT2: C77.1 IC5.3(+IN_A) R27.1
CODEC_BCLK: IC6.2(BCLK)
CODEC_DIN: IC6.5(DIN)
CODEC_DOUT: IC6.4(DOUT)
CODEC_DREG: C71.2 C72.2 IC6.1(DREG)
CODEC_FSYNC: IC6.3(FSYNC)
CODEC_GPO: IC6.11(GPO)
CODEC_IN1: J6.3 R33.2 RV7.2
CODEC_IN2: J7.3 R36.2 RV8.2
CODEC_MCBIAS: C73.2 IC6.14(MICBIAS)
CODEC_MD1: IC6.7(MD1)
CODEC_MD2: IC6.8(MD2)
CODEC_MD3: IC6.9(MD3)
CODEC_MD4: IC6.10(MD4) R29.2
CODEC_MD5: IC6.12(MD5) R28.1
CODEC_OUT1: C80.1 J5.3 RV6.2
CODEC_OUT2: C76.1 J4.3 RV5.2
CODEC_VREF: C70.2 IC6.24(VREF)
DAC_OUT1: C79.2 IC6.20(OUT1P)
DAC_OUT2: C74.2 IC6.21(OUT2P)
NetC74_1: C74.1 R26.1 R27.2
NetC76_2: C76.2 IC5.1(OUT_A) IC5.2(-IN_A)
NetC79_1: C79.1 R30.1 R31.2
NetC80_2: C80.2 IC5.6(-IN_B) IC5.7(OUT_B)
NetC84_2: C84.2 C86.2 R33.1 R34.2
NetC85_2: C85.2 IC7.1(OUT_A) IC7.2(-IN_A)
NetC87_2: C87.2 C89.2 R36.1 R37.2
NetC88_2: C88.2 IC7.6(-IN_B) IC7.7(OUT_B)

Not connected (* = marked no-connect by the designer): IC6 19(OUT1M)* 22(OUT2M)*

### Notes on the sheet
- (near IC6) Selected I2S Target Mode

### Library data of the parts
C64 C67 C68 C71 C75 C76 C78 C80 C82 C85 C88 = CAP_0603: Capacitor SMD 0603; Manufacturer: *; Manufacturer Part Number: *; Distributor Link: *; LCSC: *; Rating: *; Dielectric: *
C65 C66 C69 C70 C72-C74 C77 C79 C81 C83 C84 C86 C87 C89 = CAP_0402: Capacitor SMD 0402; Manufacturer: *; Manufacturer Part Number: *; Distributor Link: *; LCSC: *; Rating: *; Dielectric: *
IC5 IC7 = TLV3542IDGKR: as IC10 on sheet IsolationBarriers; Datasheet Link: http://www.ti.com/lit/gpn/tlv3542; Height: 1.1mm; Manufacturer_Part_Number: TLV3542IDGKR; Mouser Part Number: 595-TLV3542IDGKR; Mouser Price/Stock: https://www.mouser.co.uk/ProductDetail/Texas-Instruments/TLV3542IDGKR?qs=9lcNTSmDlCr5gl2sVJgJdw%3D%3D; Arrow Part Number: TLV3542IDGKR; Arrow Price/Stock: https://www.arrow.com/en/products/tlv3542idgkr/texas-instruments
IC6 = TAC5142IRGER: Integrated Circuit; Manufacturer_Name: Texas Instruments; Datasheet Link: https://www.ti.com/lit/ds/symlink/tac5142.pdf?ts=1734594132889&ref_url=https%253A%252F%252Fwww.ti.com%252Fproduct%252FTAC5142; Height: 1mm; Manufacturer_Part_Number: TAC5142IRGER
J4-J7 = 73100-0105: Connector; Manufacturer_Name: Molex; Datasheet Link: http://www.farnell.com/datasheets/2125064.pdf; Manufacturer_Part_Number: 73100-0105; Mouser Part Number: 538-73100-0105; Mouser Price/Stock: https://www.mouser.co.uk/ProductDetail/Molex/73100-0105?qs=K8BHR703ZXgAHDUsVPihfA%3D%3D
R26-R37 = RES_0402: Resistor SMD 0402; Manufacturer: *; Manufacturer Part Number: *; Distributor Link: *; LCSC: *
RV5-RV8 = CG0402MLU-3.3G: ESD Diode; Manufacturer_Name: Bourns; Datasheet Link: https://www.bourns.com/docs/Product-Datasheets/MLU.pdf; Height: 0.41mm; Manufacturer_Part_Number: CG0402MLU-3.3G; Mouser Part Number: 652-CG0402MLU-3.3G; Mouser Price/Stock: https://www.mouser.co.uk/ProductDetail/Bourns/CG0402MLU-3.3G?qs=m8myXnDJXpWVM8EQWErxtQ%3D%3D; Arrow Part Number: CG0402MLU-3.3G; Arrow Price/Stock: https://www.arrow.com/en/products/cg0402mlu-3.3g/bourns?utm_currency=USD&region=nac

## Nets that join several sheets
+1V8: PowerSupply (C11.2 C12.2 L2.2 R8.2), USBHSULPI (C58.2 U2.21)
+3V3: PowerSupply (6 pins), Decoupling (50 pins), MCUConfig (6 pins), SDRAMModule (14 pins), USBHSULPI (8 pins), IsolationBarriers (C90.2 C98.2 IC9.1 IC11.1)
+3V3_ANALOG: IsolationBarriers (12 pins), AudioCodec (C64.2 C65.2 IC6.6 R28.2)
+3V3_FE: IsolationBarriers (8 pins), AudioCodec (9 pins)
+5V0: PowerSupply (13 pins), IsolationBarriers (C92.2 IC8.1 R38.1)
GND: PowerSupply (28 pins), Decoupling (56 pins), MCUConfig (11 pins), SDRAMModule (14 pins), USBHSULPI (19 pins), IsolationBarriers (9 pins)
GNDANA: IsolationBarriers (19 pins), AudioCodec (41 pins)
VBIAS1: IsolationBarriers (IC10.6 IC10.7), AudioCodec (R30.2 R32.2)
VBIAS2: IsolationBarriers (IC10.1 IC10.2), AudioCodec (R26.2 R35.2)
CODEC_BCLK: IsolationBarriers (IC9.14), AudioCodec (IC6.2)
CODEC_DIN: IsolationBarriers (IC9.11), AudioCodec (IC6.5)
CODEC_DOUT: IsolationBarriers (IC9.12), AudioCodec (IC6.4)
CODEC_FSYNC: IsolationBarriers (IC9.13), AudioCodec (IC6.3)
CODEC_GPO: IsolationBarriers (IC11.11), AudioCodec (IC6.11)
CODEC_MD1: IsolationBarriers (IC11.14), AudioCodec (IC6.7)
CODEC_MD2: IsolationBarriers (IC11.13), AudioCodec (IC6.8)
CODEC_MD3: IsolationBarriers (IC11.12), AudioCodec (IC6.9)
FMC_A0: SDRAMModule (IC4.23), GPIOPins (IC3.18)
FMC_A1: SDRAMModule (IC4.24), GPIOPins (IC3.19)
FMC_A2: SDRAMModule (IC4.25), GPIOPins (IC3.20)
FMC_A3: SDRAMModule (IC4.26), GPIOPins (IC3.21)
FMC_A4: SDRAMModule (IC4.29), GPIOPins (IC3.22)
FMC_A5: SDRAMModule (IC4.30), GPIOPins (IC3.23)
FMC_A6: SDRAMModule (IC4.31), GPIOPins (IC3.59)
FMC_A7: SDRAMModule (IC4.32), GPIOPins (IC3.60)
FMC_A8: SDRAMModule (IC4.33), GPIOPins (IC3.61)
FMC_A9: SDRAMModule (IC4.34), GPIOPins (IC3.62)
FMC_A10: SDRAMModule (IC4.22), GPIOPins (IC3.63)
FMC_A11: SDRAMModule (IC4.35), GPIOPins (IC3.66)
FMC_BA0: SDRAMModule (IC4.20), GPIOPins (IC3.114)
FMC_BA1: SDRAMModule (IC4.21), GPIOPins (IC3.115)
FMC_D0: SDRAMModule (IC4.2), GPIOPins (IC3.97)
FMC_D1: SDRAMModule (IC4.4), GPIOPins (IC3.98)
FMC_D2: SDRAMModule (IC4.5), GPIOPins (IC3.143)
FMC_D3: SDRAMModule (IC4.7), GPIOPins (IC3.144)
FMC_D4: SDRAMModule (IC4.8), GPIOPins (IC3.67)
FMC_D5: SDRAMModule (IC4.10), GPIOPins (IC3.68)
FMC_D6: SDRAMModule (IC4.11), GPIOPins (IC3.69)
FMC_D7: SDRAMModule (IC4.13), GPIOPins (IC3.72)
FMC_D8: SDRAMModule (IC4.42), GPIOPins (IC3.73)
FMC_D9: SDRAMModule (IC4.44), GPIOPins (IC3.74)
FMC_D10: SDRAMModule (IC4.45), GPIOPins (IC3.75)
FMC_D11: SDRAMModule (IC4.47), GPIOPins (IC3.76)
FMC_D12: SDRAMModule (IC4.48), GPIOPins (IC3.77)
FMC_D13: SDRAMModule (IC4.50), GPIOPins (IC3.89)
FMC_D14: SDRAMModule (IC4.51), GPIOPins (IC3.90)
FMC_D15: SDRAMModule (IC4.53), GPIOPins (IC3.91)
FMC_NBL0: SDRAMModule (IC4.15), GPIOPins (IC3.170)
FMC_NBL1: SDRAMModule (IC4.39), GPIOPins (IC3.171)
FMC_SDCKE0: SDRAMModule (IC4.37), GPIOPins (IC3.54)
FMC_SDCLK: SDRAMModule (IC4.38), GPIOPins (IC3.118)
FMC_SDNCAS: SDRAMModule (IC4.17), GPIOPins (IC3.161)
FMC_SDNE0: SDRAMModule (IC4.19), GPIOPins (IC3.53)
FMC_SDNRAS: SDRAMModule (IC4.18), GPIOPins (IC3.58)
FMC_SDNWE: SDRAMModule (IC4.16), GPIOPins (IC3.52)
GPIO_CODEC_MD1: GPIOPins (IC3.148), IsolationBarriers (IC11.3)
GPIO_CODEC_MD2: GPIOPins (IC3.147), IsolationBarriers (IC11.4)
GPIO_CODEC_MD3: GPIOPins (IC3.146), IsolationBarriers (IC11.5)
GPIO_EXTI6: GPIOPins (IC3.149), IsolationBarriers (IC11.6)
I2S1_SCK: GPIOPins (IC3.155), IsolationBarriers (IC9.3)
I2S1_SDI: GPIOPins (IC3.153), IsolationBarriers (IC9.5)
I2S1_SDO: GPIOPins (IC3.150), IsolationBarriers (IC9.6)
I2S1_WS: GPIOPins (IC3.154), IsolationBarriers (IC9.4)
QSPI_CLK: MCUConfig (U1.6), GPIOPins (IC3.30)
QSPI_CS#: MCUConfig (U1.1), GPIOPins (IC3.165)
QSPI_IO0: MCUConfig (U1.5), GPIOPins (IC3.28)
QSPI_IO1: MCUConfig (U1.2), GPIOPins (IC3.29)
QSPI_IO2: MCUConfig (U1.3), GPIOPins (IC3.27)
QSPI_IO3: MCUConfig (U1.7), GPIOPins (IC3.26)
SWCLK: MCUConfig (D2.29 J2.4), GPIOPins (R19.1)
SWDIO: MCUConfig (D2.110 J2.2), GPIOPins (R18.1)
SWO: MCUConfig (D2.47 J2.6), GPIOPins (R17.1)
ULPI_CLK: GPIOPins (IC3.50), USBHSULPI (U2.12)
ULPI_D0: GPIOPins (IC3.46), USBHSULPI (U2.16)
ULPI_D1: GPIOPins (IC3.55), USBHSULPI (U2.15)
ULPI_D2: GPIOPins (IC3.56), USBHSULPI (U2.14)
ULPI_D3: GPIOPins (IC3.78), USBHSULPI (U2.13)
ULPI_D4: GPIOPins (IC3.79), USBHSULPI (U2.11)
ULPI_D5: GPIOPins (IC3.85), USBHSULPI (U2.10)
ULPI_D6: GPIOPins (IC3.86), USBHSULPI (U2.9)
ULPI_D7: GPIOPins (IC3.164), USBHSULPI (U2.8)
ULPI_DIR: GPIOPins (IC3.36), USBHSULPI (U2.19)
ULPI_NXT: GPIOPins (IC3.37), USBHSULPI (U2.18)
ULPI_STP: GPIOPins (IC3.34), USBHSULPI (U2.20)
USB_FS_D_N: PowerSupply (J1.A7 J1.B7 RV2.2), GPIOPins (IC3.130)
USB_FS_D_P: PowerSupply (J1.A6 J1.B6 RV1.2), GPIOPins (IC3.131)
USB_NRESET_R: GPIOPins (IC3.51), USBHSULPI (R24.2 U2.22)